# EAGLE board Pack Supervisor 97x127mm Rev B (EAGLE 7.2.0)
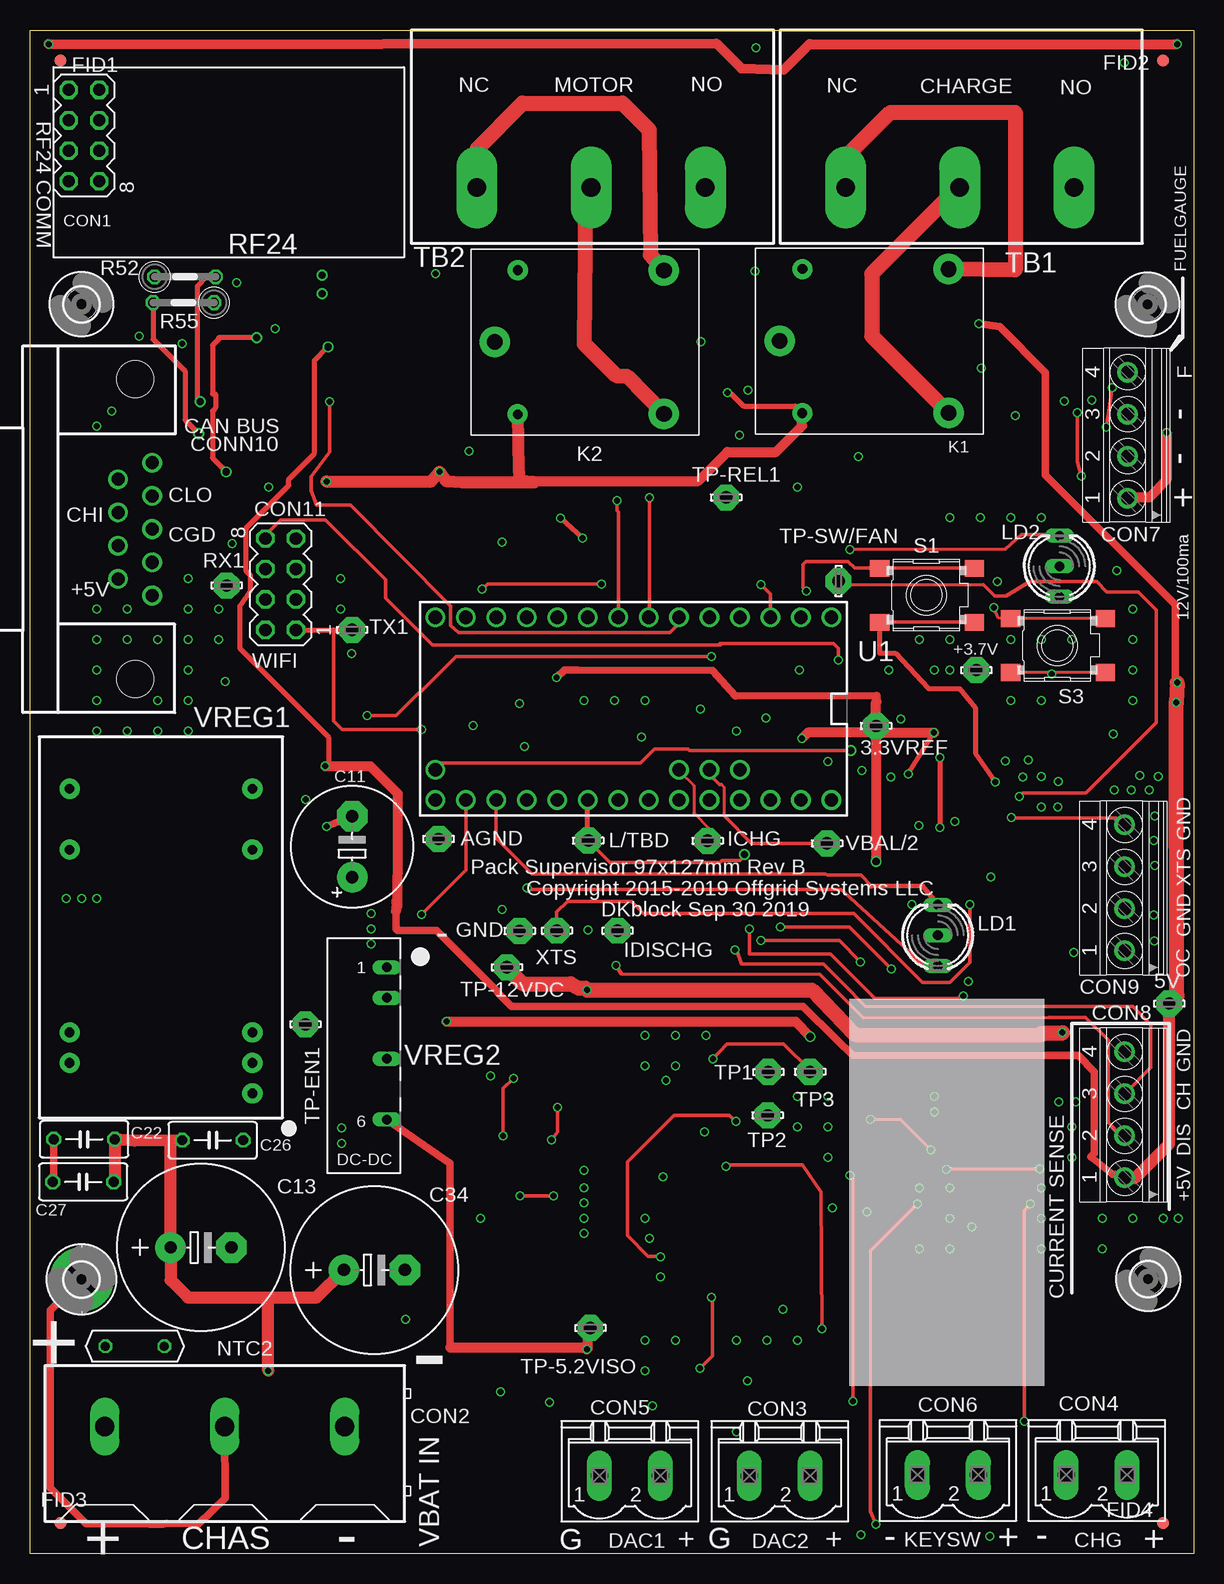
[diagram p2: board, top side]
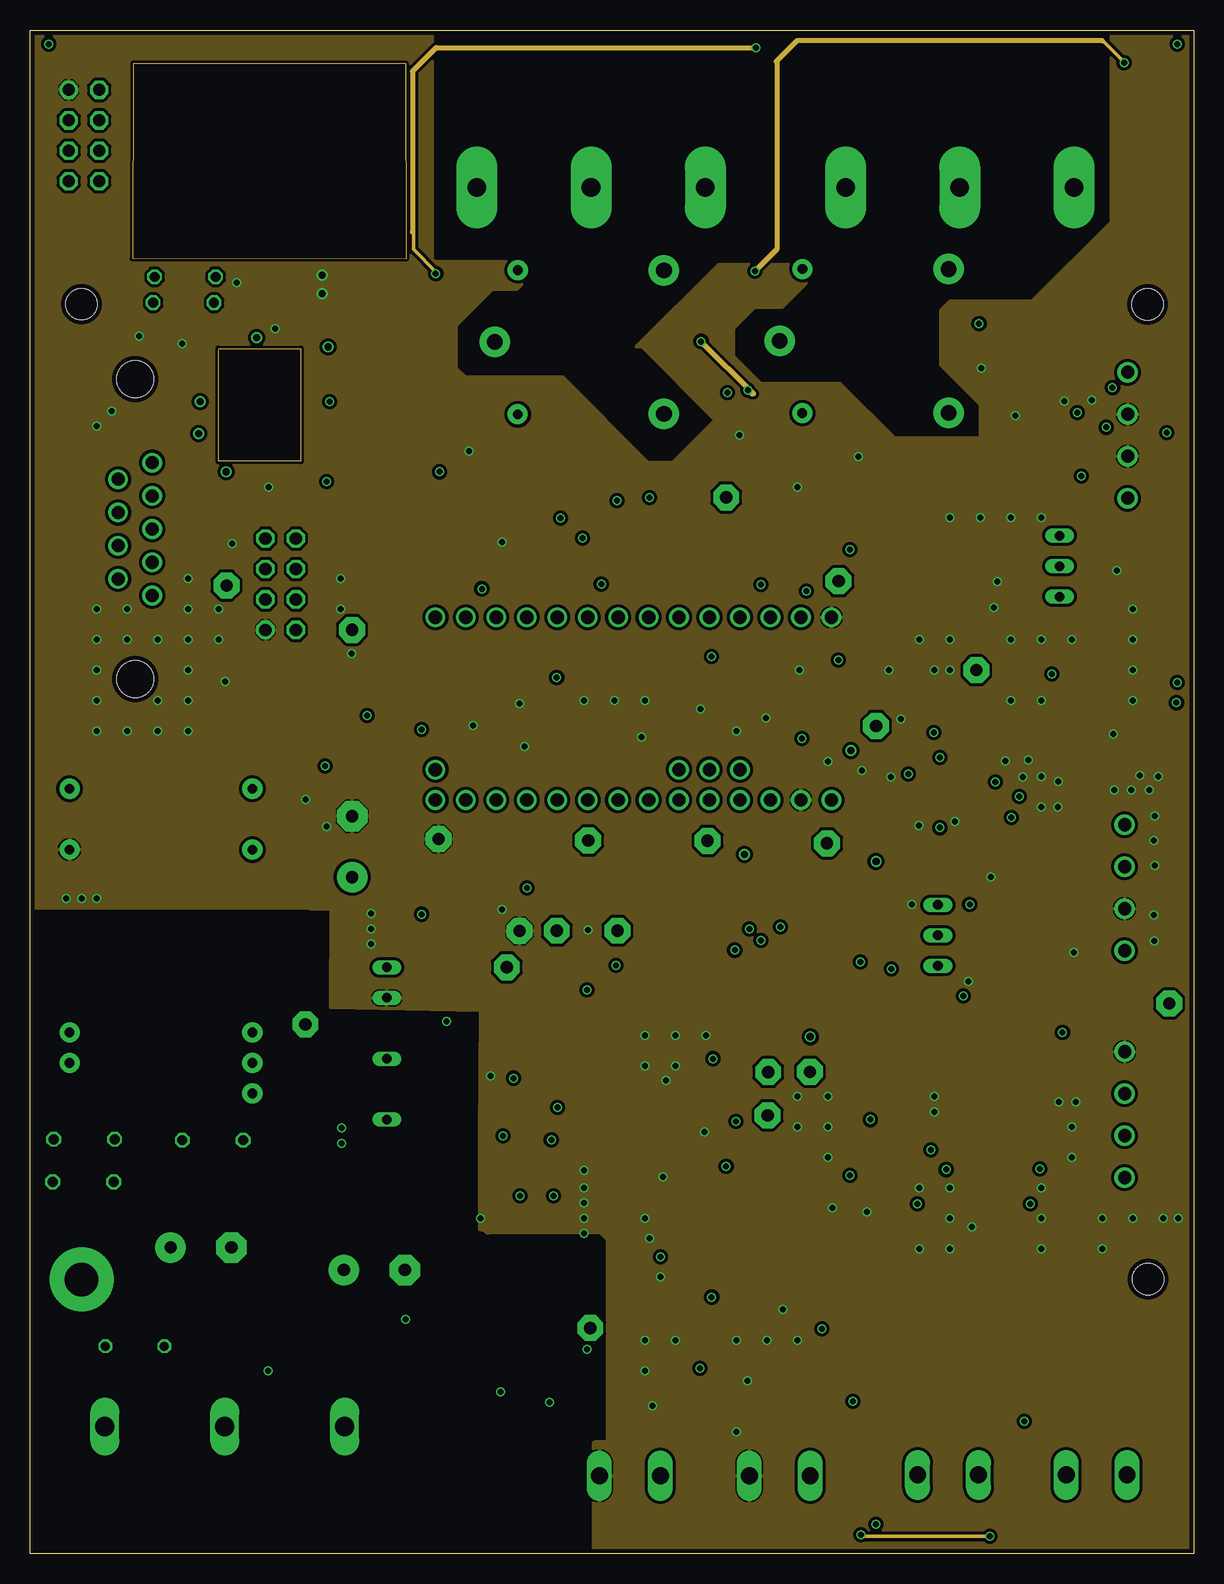
[diagram p3: board, inner layer InnerlayerGND1]
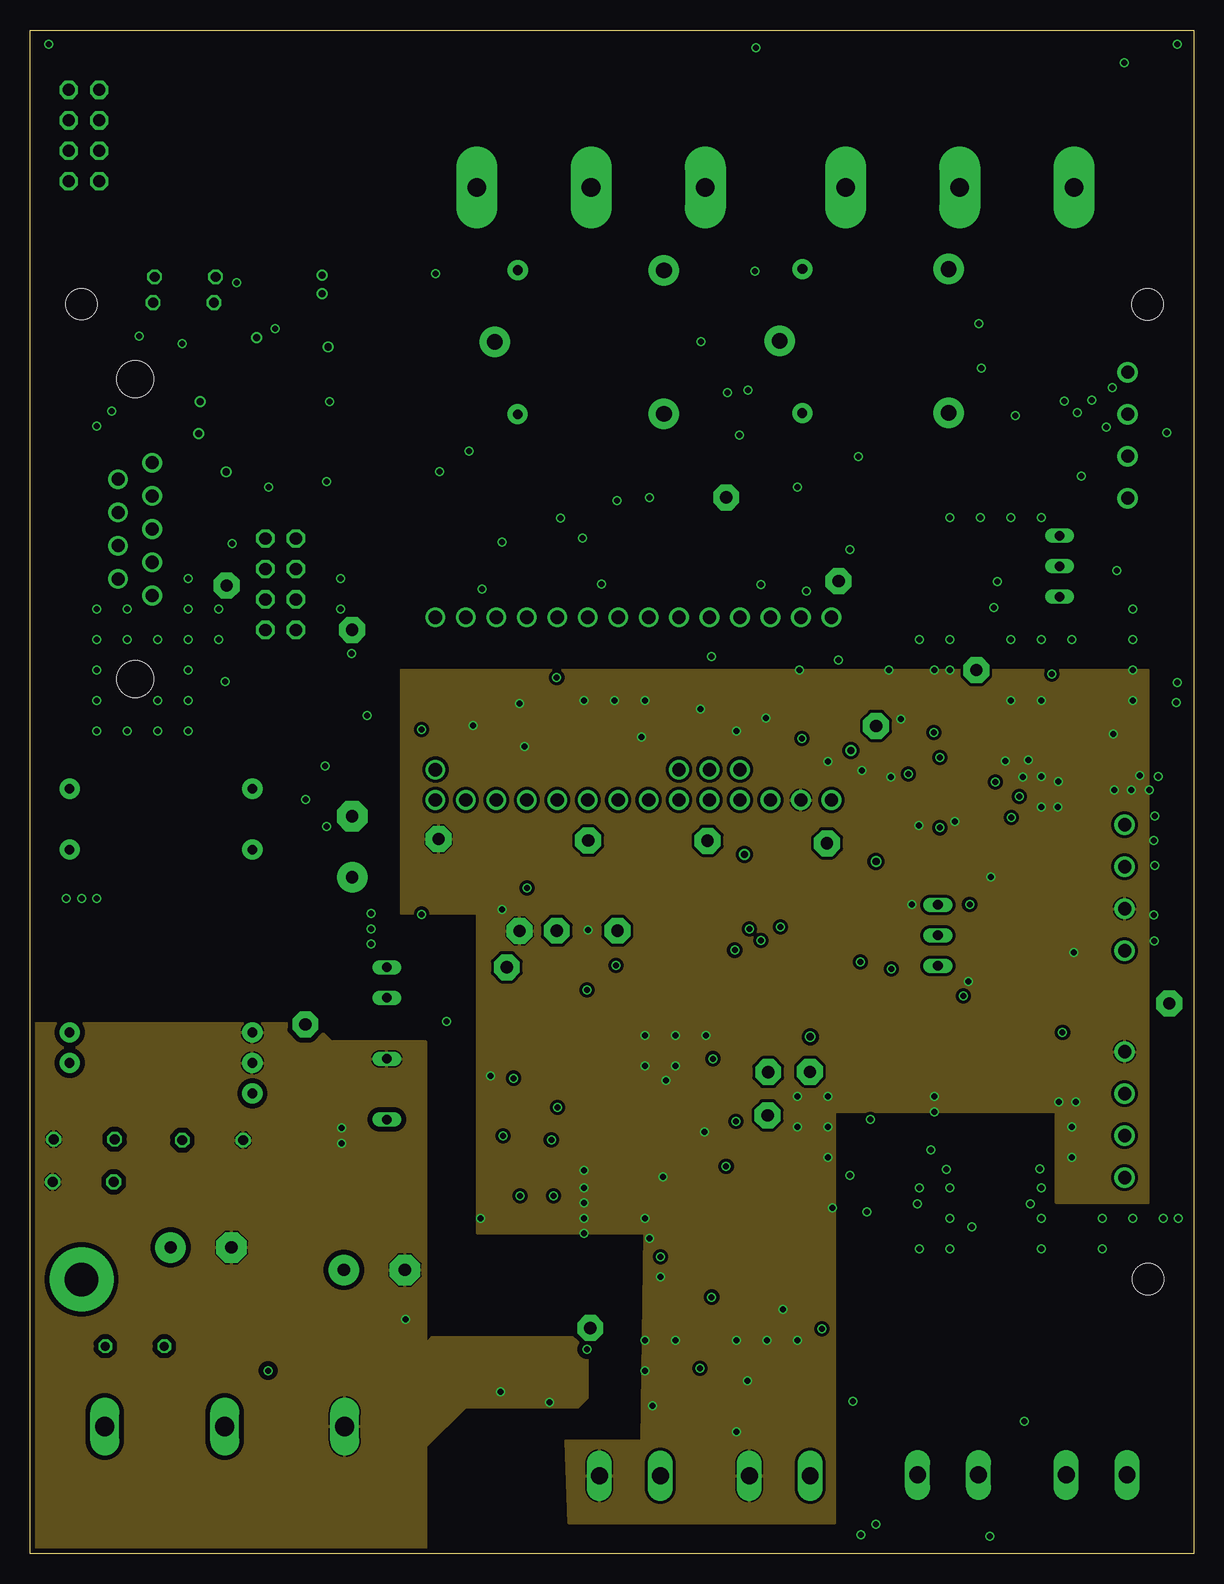
[diagram p4: board, inner layer InnerlayerAGND]
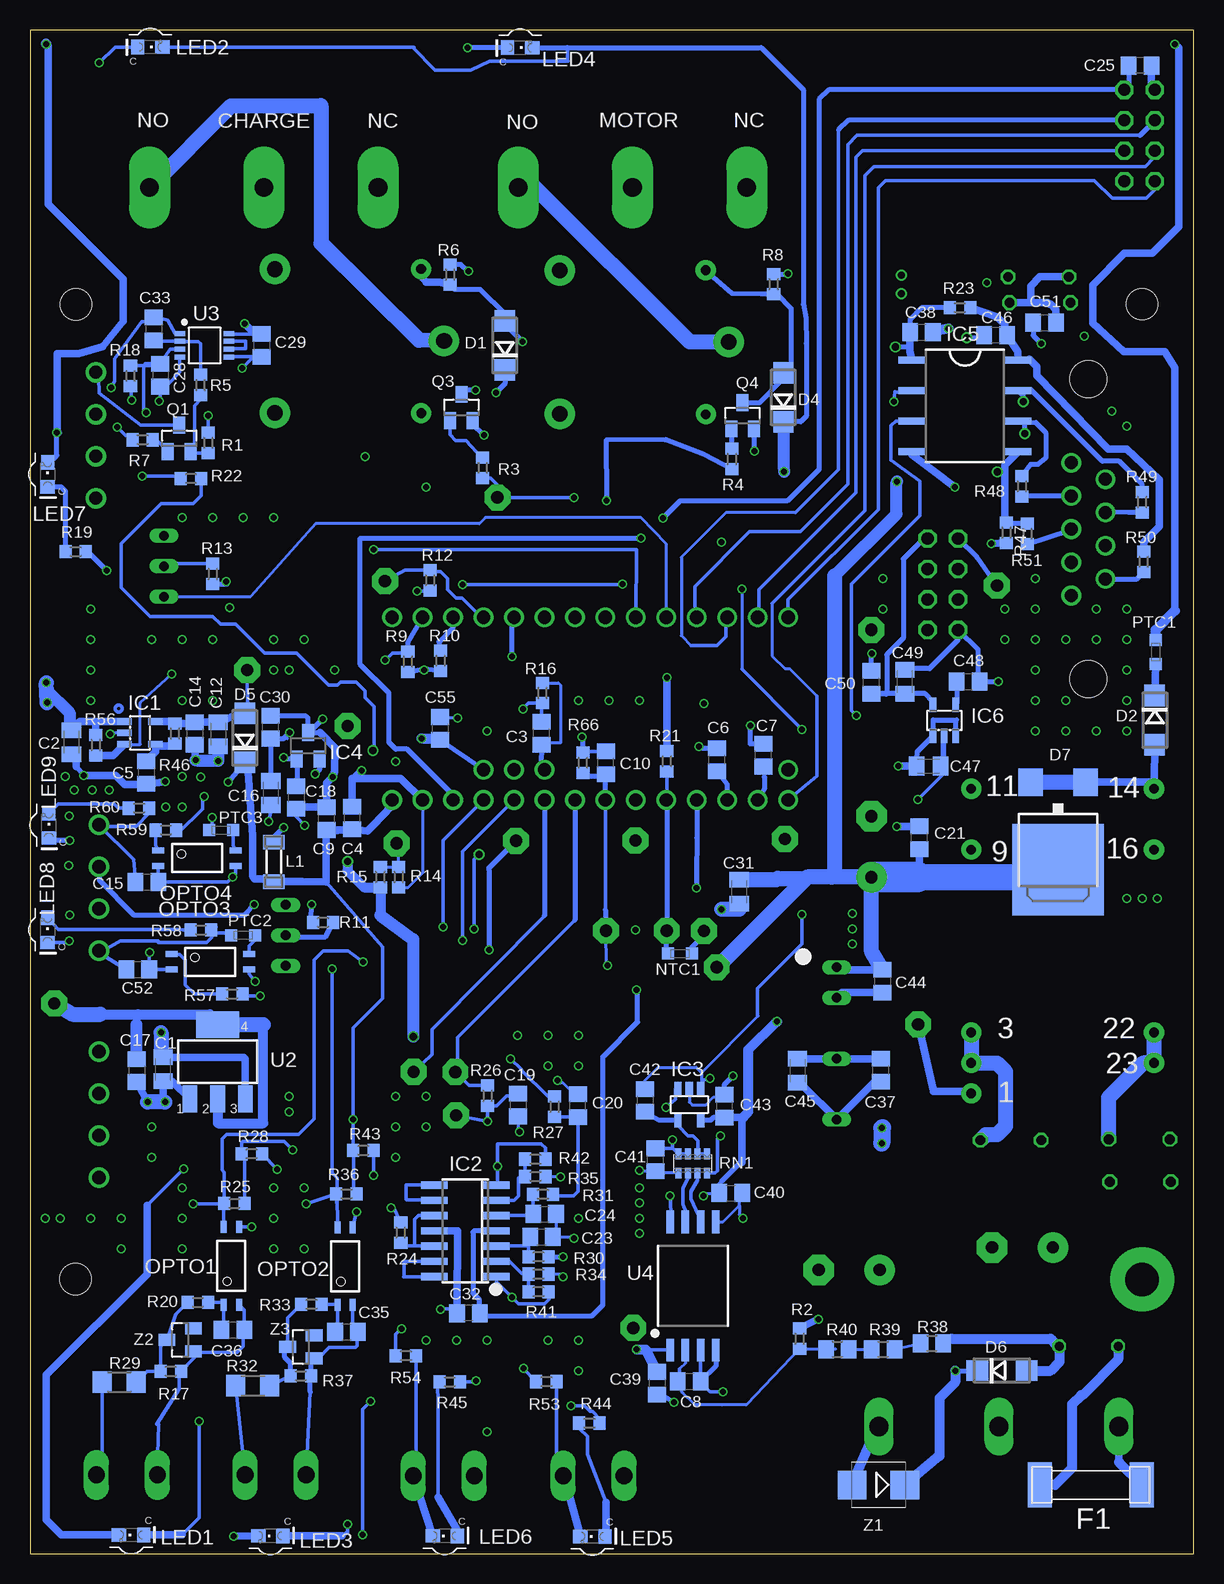
[diagram p5: board, bottom side, seen from below]

Size 97 x 127 mm. Coordinates in mm from the lower left corner, seen from the top.
Outline: 0,127 97,127 97,0 0,0
Outline: 0,0 0,127
Copper layers (1+2*15+16): Top 0.035559375mm / dielectric 0.17018125mm / InnerlayerGND1 0.01778125mm / dielectric 47mil / InnerlayerAGND 0.01778125mm / dielectric 0.17018125mm / Bottom 0.035559375mm
Design rules "Offgrid 4 layer design rules for low voltage areas on board": minimum track width 10mil, minimum drill 10mil, track to track 10mil, track to pad 10mil, pad to pad 10mil, via to via 10mil, smd to smd 5mil, copper to edge 15mil, drill to drill 5mil, minimum pad ring 7mil, minimum via ring 4mil, stop-mask expansion 3mil, vias tented up to drill 0mil, thermal gap 5mil

## Footprints (pad centres in the part's own frame; a part is rotated, then mirrored left to right if it is on the bottom)
LSP10 = drill 1.016 pad 2.159 octagon: MP 0,0
C0805K = smd 1.3 x 1.6: 1 -1,0; 2 1,0
TIMS_INDUCTOR_C0805 = smd 1.3 x 1.5: 1 -0.95,0; 2 0.95,0
E5-10,5 = drill 1.016 pad 2.54: + -2.54,0 | drill 1.016 pad 2.54 octagon: - 2.54,0
E5-13 = drill 1.016 pad 2.54: + -2.54,0 | drill 1.016 pad 2.54 octagon: - 2.54,0
RCL_C050-030X075 = drill 0.813 octagon: 1 -2.54,0; 2 2.54,0
C0805 = smd 1.3 x 1.5: 1 -0.95,0; 2 0.95,0
NRF24L01 = drill 1.016 octagon: 1 -1.27,3.81; 2 1.27,3.81; 3 -1.27,1.27; 4 1.27,1.27; 5 -1.27,-1.27; 6 1.27,-1.27; 7 -1.27,-3.81; 8 1.27,-3.81
TYCO-796739-3 = drill 1.6 long: 1 -10,-0.08; 2 0,-0.08; 3 10,-0.08
MSTBV2 = drill 1.397 long: 1 -2.54,0; 2 2.54,0
1751264 = drill 1.1 pad 1.7: 1 -5.25,-0.1; 2 -1.75,-0.1; 3 1.75,-0.1; 4 5.25,-0.1
MA04-2 = drill 1.016 octagon: 1 -3.81,-1.27; 2 -3.81,1.27; 3 -1.27,-1.27; 4 -1.27,1.27; 5 1.27,-1.27; 6 1.27,1.27; 7 3.81,-1.27; 8 3.81,1.27
H5M09RA = drill 1.092: 1 -5.537,1.422; 2 -2.769,1.422; 3 0,1.422; 4 2.769,1.422; 5 5.537,1.422; 6 -4.153,-1.422; 7 -1.384,-1.422; 8 1.384,-1.422; 9 4.153,-1.422 | hole 3.048: -12.497,0; 12.497,0
DO214AC = smd 1.8 x 1.7: A 2.05,0; C -2.05,0
TO252-FATPADS = smd 7.62 x 7.62: DRAIN 0,2.5 | smd 2.032 x 2.286: GATE -2.28,-4.8; SOURCE 2.28,-4.8
SCHURTER-UMT250 = smd 2 x 3.75: P$1 -4.21,0; P$2 4.29,0
TP10R = smd 1 x 1: TP 0,0
2,6 = hole 2.591: 0,0
2,8-PAD = drill 2.8 pad 5.334: B2,8 0,0
SOT23-5 = smd 0.55 x 1.2: 1 -0.95,-1.3; 2 0,-1.3; 3 0.95,-1.3; 4 0.95,1.3; 5 -0.95,1.3
SO14 = smd 0.6 x 2.2: 1 -3.81,-2.6; 2 -2.54,-2.6; 3 -1.27,-2.6; 4 0,-2.6; 5 1.27,-2.6; 6 2.54,-2.6; 7 3.81,-2.6; 8 3.81,2.6; 9 2.54,2.6; 10 1.27,2.6; 11 0,2.6; 12 -1.27,2.6; 13 -2.54,2.6; 14 -3.81,2.6
SOT23-5' = smd 0.6 x 1.2: 1 -0.95,-1.306; 2 0,-1.306; 3 0.95,-1.306; 4 0.95,1.306; 5 -0.95,1.306
SOT23 = smd 1 x 1.4: 1 -0.95,-1.1; 2 0.95,-1.1; 3 0,1.1
DUB-R-PDSO-G8 = smd 0.6 x 2.2: 1 -3.81,-4.445; 2 -1.27,-4.445; 3 1.27,-4.445; 4 3.81,-4.445; 5 3.81,4.445; 6 1.27,4.445; 7 -1.27,4.445; 8 -3.81,4.445
ORWH = drill 1.3 pad 2.54: COM -8,0.02; NC 6.09,-5.97; NO 6.09,6 | drill 0.813 pad 1.676: V+ -6.1,-6; V- -6.09,6.01
SM-1206 = smd 1.2 x 1.8: 1 -1.65,0; 2 1.65,0
DUOLED-C-5MM = drill 0.813 long: AR 2.54,0; AX -2.54,0; C 0,0
LITEON-LTST-S270KRKT = smd 1.1 x 1.2: ANODE 0,1 | smd 1.2 x 1.1: CATHODE 0,-1.05
0603 = smd 1 x 1: 1 -1,0; 2 1,0
D7-PACKAGE = drill 0.75 octagon: 1 -2.454,0; 2 2.454,0
MINI-FLAT-4 = smd 1 x 0.5: 1 -3.24,0.635; 2 -3.24,-0.635; 3 3.24,-0.635; 4 3.24,0.635
CT/CN0603 = smd 1 x 1: 1 -1,0; 2 1,0
R0603 = smd 1 x 1.1: 1 -0.85,0; 2 0.85,0
R1206 = smd 1.6 x 1.803: 1 -1.422,0; 2 1.422,0
R0805 = smd 1.3 x 1.5: 1 -0.95,0; 2 0.95,0
0207/5V = drill 0.813 octagon: 1 -2.54,0; 2 2.54,0
CTS742C083 = smd 0.5 x 0.9: 1 -1.2,-0.8; 2 -0.4,-0.8; 3 0.4,-0.8; 4 1.2,-0.8; 5 1.2,0.8; 6 0.4,0.8; 7 -0.4,0.8; 8 -1.2,0.8
PTS645 = smd 1.6 x 1.4: 1 -4.2,2.25; 2 3.7,2.25; 3 -4.2,-2.25; 4 3.7,-2.25
TE-5-1437652-4 = drill 1.549 pad 3.429 long: 1 -9.461,-0.08; 2 0.064,-0.08; 3 9.588,-0.08
TEENSY_3.0-DIP+ANALOG+DAC = drill 1.1: 0 -7.62,13.97; 1 -7.62,11.43; 2 -7.62,8.89; 3 -7.62,6.35; 3.3V 7.62,11.43; 4 -7.62,3.81; 5 -7.62,1.27; 6 -7.62,-1.27; 7 -7.62,-3.81; 8 -7.62,-6.35; 9 -7.62,-8.89; 10 -7.62,-11.43; 11 -7.62,-13.97; 12 -7.62,-16.51; 13 7.62,-16.51; 14 5.08,-16.51; 14/A0 7.62,-13.97; 15/A1 7.62,-11.43; 16/A2 7.62,-8.89; 17/A3 7.62,-6.35; 18/A4 7.62,-3.81; 19/A5 7.62,-1.27; 20/A6 7.62,1.27; 21/A7 7.62,3.81; 22/A8 7.62,6.35; 23/A9 7.62,8.89; A10 5.08,6.35; A11 5.08,3.81; AGND 7.62,13.97; AREF 5.08,8.89; GND -7.62,16.51; VIN 7.62,16.51
SOT223 = smd 1.219 x 2.235: 1 -2.311,-3.099; 2 0,-3.099; 3 2.311,-3.099 | smd 3.6 x 2.2: 4 0,3.099
LT6004-MSOP = smd 0.889 x 0.419: 1 -2.238,1.746; 2 -2.238,1.096; 3 -2.238,0.446; 4 -2.238,-0.205; 5 1.851,-0.205; 6 1.851,0.446; 7 1.851,1.096; 8 1.851,1.746
STRETCH-SO8 = smd 0.635 x 1.905: 1 -3.81,-5.339; 2 -2.54,-5.339; 3 -1.27,-5.339; 4 0,-5.339; 5 0,5.339; 6 -1.27,5.339; 7 -2.54,5.339; 8 -3.81,5.339
MR0811S-12 = drill 0.8 pad 1.676: 1 -7.62,10.16; 2 -7.62,7.62; 3 -7.62,5.08; 9 -7.62,-10.16; 11 -7.62,-15.24; 14 7.62,-15.24; 16 7.62,-10.16; 22 7.62,5.08; 23 7.62,7.62
MURATA-MEF = drill 0.813 long: 1 0,5.08; 2 0,2.54; 4 0,-2.54; 6 0,-7.62
SMB = smd 2.4 x 2.4: A 2.2,0; C -2.2,0
TIMS_DIODE_SOT23 = smd 1 x 1.4: 1 -0.95,-1.1; 2 0.95,-1.1; 3 0,1.1

## Placement (x,y rotation side)
3.3VREF  LSP10  [LSP10]  70.54,68.99 0 top
5V  LSP10  [LSP10]  94.97,45.85 0 top
+3.7V  LSP10  [LSP10]  78.89,73.63 0 top
AGND  LSP10  [LSP10]  34.06,59.56 0 top
C1  10uf/16V/X5R  [C0805K]  85.9,40.36 270 bottom
C2  10uf/16V/X5R  [C0805K]  93.55,67.64 270 bottom
C3  1/16V  [TIMS_INDUCTOR_C0805]  54.36,68.38 90 bottom
C4  1/16V  [TIMS_INDUCTOR_C0805]  70.13,61.32 90 bottom
C5  100p  [TIMS_INDUCTOR_C0805]  87.33,65.1 270 bottom
C6  .01u  [TIMS_INDUCTOR_C0805]  39.73,66.17 90 bottom
C7  .01u  [TIMS_INDUCTOR_C0805]  35.86,66.55 90 bottom
C8  1/16V  [TIMS_INDUCTOR_C0805]  42.04,14.35 0 bottom
C9  0.1/16V  [TIMS_INDUCTOR_C0805]  72.26,61.26 90 bottom
C10  1/16V  [TIMS_INDUCTOR_C0805]  49,65.92 90 bottom
C11  330/25V  [E5-10,5]  26.86,58.92 90 top
C12  10uf/16V/X5R  [C0805K]  81.31,68.3 270 bottom
C13  47/250V  [E5-13]  14.26,25.52 0 top
C14  0.1/30V  [TIMS_INDUCTOR_C0805]  83.26,68.35 270 bottom
C15  .01u  [TIMS_INDUCTOR_C0805]  87.25,55.98 0 bottom
C16  10uf/16V  [C0805K]  76.91,63.4 270 bottom
C17  1/16V  [TIMS_INDUCTOR_C0805]  88.11,40.26 270 bottom
C18  0.1/30V  [TIMS_INDUCTOR_C0805]  74.8,63.02 270 bottom
C19  1/16V  [TIMS_INDUCTOR_C0805]  56.31,37.39 270 bottom
C20  1/16V  [TIMS_INDUCTOR_C0805]  51.33,37.34 90 bottom
C21  1/16V  [TIMS_INDUCTOR_C0805]  22.86,59.66 90 bottom
C22  1uf/250V  [RCL_C050-030X075]  4.52,34.53 180 top
C23  1/16V  [TIMS_INDUCTOR_C0805]  54.36,26.39 0 bottom
C24  1/16V  [TIMS_INDUCTOR_C0805]  54.1,28.3 0 bottom
C25  1/16V  [TIMS_INDUCTOR_C0805]  4.47,124.04 180 bottom
C26  1uf/250V  [RCL_C050-030X075]  15.24,34.45 0 top
C27  1uf/250V  [RCL_C050-030X075]  4.44,30.98 180 top
C28  1/16V  [TIMS_INDUCTOR_C0805]  86.13,98.22 270 bottom
C29  1/16V  [TIMS_INDUCTOR_C0805]  77.7,100.71 270 bottom
C30  0.1/30V  [TIMS_INDUCTOR_C0805]  76.94,68.88 90 bottom
C31  10uf/16V/X5R  [C0805K]  37.87,55.17 270 bottom
C32  1/16V  [TIMS_INDUCTOR_C0805]  60.45,20.04 180 bottom
C33  1000p  [TIMS_INDUCTOR_C0805]  86.69,102.08 270 bottom
C34  47/250V  [E5-13]  28.71,23.64 0 top
C35  1/16V  [TIMS_INDUCTOR_C0805]  70.61,18.49 0 bottom
C36  1/16V  [TIMS_INDUCTOR_C0805]  80.09,18.64 0 bottom
C37  1/16V  [TIMS_INDUCTOR_C0805]  26.07,40.3 90 bottom
C38  1/16V  [TIMS_INDUCTOR_C0805]  22.68,101.8 0 bottom
C39  1/16V  [TIMS_INDUCTOR_C0805]  44.73,14.2 270 bottom
C40  1/16V  [TIMS_INDUCTOR_C0805]  38.58,30.05 0 bottom
C41  0.1  [TIMS_INDUCTOR_C0805]  44.86,32.82 90 bottom
C42  0.1  [TIMS_INDUCTOR_C0805]  45.72,37.77 270 bottom
C43  1/16V  [TIMS_INDUCTOR_C0805]  39.09,37.29 90 bottom
C44  1/16V  [TIMS_INDUCTOR_C0805]  25.93,47.7 270 bottom
C45  10uf/16V/X5R  [C0805K]  33.02,40.25 90 bottom
C46  1/16V  [TIMS_INDUCTOR_C0805]  16.5,101.58 0 bottom
C47  10uf/16V/X5R  [C0805K]  22.09,65.64 0 bottom
C48  100p  [TIMS_INDUCTOR_C0805]  18.79,72.68 0 bottom
C49  10uf/16V/X5R  [C0805K]  24.07,72.68 90 bottom
C50  0.1/30V  [TIMS_INDUCTOR_C0805]  26.85,72.62 90 bottom
C51  0.1  [TIMS_INDUCTOR_C0805]  12.42,102.62 0 bottom
C52  .01u  [TIMS_INDUCTOR_C0805]  88.01,48.69 0 bottom
C55  .01u  [C0805]  62.81,68.78 270 bottom
CON1  nRF24L01+ CONNECTOR  [NRF24L01]  4.5,118.2 0 top
CON2  TYCO-796739-3  [TYCO-796739-3]  16.23,10.67 0 top
CON3  Phoenix 1935161  [MSTBV2]  62.51,6.48 0 top
CON4  Phoenix 1935161  [MSTBV2]  88.93,6.55 0 top
CON5  Phoenix 1935161  [MSTBV2]  50.01,6.48 0 top
CON6  Phoenix 1935161  [MSTBV2]  76.53,6.55 0 top
CON7  1751264  [1751264]  91.41,93.22 90 top
CON8  1751264  [1751264]  91.16,36.58 90 top
CON9  1751264  [1751264]  91.16,55.5 90 top
CON11  WIFI  [MA04-2]  20.9,80.8 90 top
CONN10  DB-9 Assmann A-DF 09 A/KG-T4S  [H5M09RA]  8.77,85.39 270 top
D1  CDBA140-G  [DO214AC]  57.4,100.71 90 bottom
D2  CDBA140-G  [DO214AC]  3.25,69.47 270 bottom
D4  CDBA140-G  [DO214AC]  34.19,96.37 90 bottom
D5  CDBA140-G  [DO214AC]  79.07,68 90 bottom
D6  CDBA140-G  [DO214AC]  15.98,15.24 0 bottom
D7  RFN10B3STL  [TO252-FATPADS]  11.29,59.5 180 bottom
F1  250ma  [SCHURTER-UMT250]  8.61,5.71 0 bottom
FID1  FIDUCIALTP10R  [TP10R]  2.54,124.46 0 top
FID2  FIDUCIALTP10R  [TP10R]  94.46,124.46 0 top
FID3  FIDUCIALTP10R  [TP10R]  2.54,2.54 0 top
FID4  FIDUCIALTP10R  [TP10R]  94.46,2.54 0 top
GND  LSP10  [LSP10]  40.82,51.89 0 top
H1  MOUNT-HOLE  [2,6]  4.29,104.14 0 top
H2  MOUNT-HOLE  [2,6]  93.22,22.87 0 top
H3  MOUNT-PAD-ROUND2.8  [2,8-PAD]  4.29,22.85 0 top
H4  MOUNT-HOLE  [2,6]  93.17,104.13 0 top
IC1  AP2202K-3.3TRG1  [SOT23-5]  87.83,68.4 270 bottom
IC2  TLC27L4CDR  [SO14]  60.71,26.9 90 bottom
IC3  OPA237N  [SOT23-5']  42.04,37.41 180 bottom
IC4  REF3033  [SOT23]  73.81,67.34 0 bottom
IC5  ISO1050DUB  [DUB-R-PDSO-G8]  19.05,95.67 270 bottom
IC6  AP2202K-3.3TRG1  [SOT23-5]  20.78,69.45 0 bottom
ICHG  LSP10  [LSP10]  56.49,59.41 0 top
IDISCHG  LSP10  [LSP10]  48.97,51.92 0 top
K1  ORWH  [ORWH]  70.48,101.07 0 top
K2  ORWH  [ORWH]  46.76,100.97 0 top
L1  8.2uh  [SM-1206]  76.68,57.66 270 bottom
L/TBD  LSP10  [LSP10]  46.53,59.43 0 top
LD1  "TRANSMITTING/FAULT"  [DUOLED-C-5MM]  75.69,51.54 90 top
LD2  "STATUS"  [DUOLED-C-5MM]  85.83,82.3 90 top
LED1  LITEON-LTST-S270KRKT  [LITEON-LTST-S270KRKT]  88.57,1.55 90 bottom
LED2  LITEON-LTST-S270KRKT  [LITEON-LTST-S270KRKT]  86.97,125.58 270 bottom
LED3  LITEON-LTST-S270KRKT  [LITEON-LTST-S270KRKT]  76.96,1.47 90 bottom
LED4  LITEON-LTST-S270KRKT  [LITEON-LTST-S270KRKT]  56.13,125.53 270 bottom
LED5  LITEON-LTST-S270KRKT  [LITEON-LTST-S270KRKT]  50.11,1.42 90 bottom
LED6  LITEON-LTST-S270KRKT  [LITEON-LTST-S270KRKT]  62.43,1.47 90 bottom
LED7  LITEON-LTST-S270KRKT  [LITEON-LTST-S270KRKT]  95.53,89.97 0 bottom
LED8  LITEON-LTST-S270KRKT  [LITEON-LTST-S270KRKT]  95.53,51.99 0 bottom
LED9  LITEON-LTST-S270KRKT  [LITEON-LTST-S270KRKT]  95.43,60.71 0 bottom
NTC1  100K  [0603]  42.82,50.01 0 bottom
NTC2  Cantherm MF72-012D7  [D7-PACKAGE]  8.74,17.27 180 top
OPTO1  TLP291  [MINI-FLAT-4]  80.21,23.98 90 bottom
OPTO2  TLP291  [MINI-FLAT-4]  70.74,23.95 90 bottom
OPTO3  TLP291  [MINI-FLAT-4]  81.97,49.33 0 bottom
OPTO4  TLP291  [MINI-FLAT-4]  83.08,57.96 0 bottom
PTC1  PTC FUSE - 100ma  [CT/CN0603]  3.15,75.13 270 bottom
PTC2  100ma  [CT/CN0603]  79.22,51.54 0 bottom
PTC3  100ma  [CT/CN0603]  81.05,60.3 0 bottom
Q1  IRLML2502TRPBF  [SOT23]  84.56,92.96 0 bottom
Q3  IRLML2502TRPBF  [SOT23]  61.04,95.53 0 bottom
Q4  IRLML2502TRPBF  [SOT23]  37.59,94.84 0 bottom
R1  10  [R0603]  82.14,92.58 90 bottom
R2  43.2k/0.1%  [R0603]  32.84,17.91 270 bottom
R3  1K  [R0603]  59.26,90.5 270 bottom
R4  1K  [R0603]  38.48,91.24 270 bottom
R5  1K  [R0603]  82.78,97.41 270 bottom
R6  1k  [R0603]  61.98,106.6 270 bottom
R7  20K  [R0603]  87.6,92.84 180 bottom
R8  1k  [R0603]  35,105.82 270 bottom
R9  200k  [R0603]  65.5,74.35 90 bottom
R10  200k  [R0603]  62.77,74.42 90 bottom
R11  330  [R0603]  72.57,52.6 180 bottom
R12  20k  [R0603]  63.64,81.13 90 bottom
R13  330  [R0603]  81.76,81.66 270 bottom
R14  20K  [R0603]  66.27,56.39 90 bottom
R15  20K  [R0603]  67.79,56.39 270 bottom
R16  200k  [R0603]  54.28,71.73 90 bottom
R17  1M  [R0603]  85.27,15.19 180 bottom
R18  100k  [R0603]  88.62,98.17 90 bottom
R19  1k  [R0603]  93.19,83.52 0 bottom
R20  1.8k  [R0603]  83.01,20.93 180 bottom
R21  200k  [R0603]  43.92,66.04 90 bottom
R22  1M  [R0603]  83.59,89.61 0 bottom
R23  10  [R0603]  19.47,103.85 0 bottom
R24  20K  [R0603]  66.09,26.75 270 bottom
R25  10K  [R0603]  79.96,29.18 180 bottom
R26  10K  [R0603]  58.85,38.15 90 bottom
R27  10K  [R0603]  53.26,37.24 90 bottom
R28  1K  [R0603]  78.51,33.32 180 bottom
R29  3.3k/1206/5%  [R1206]  89.56,14.3 180 bottom
R30  10K  [R0603]  54.61,24.74 0 bottom
R31  10K  [R0603]  54.23,29.95 0 bottom
R32  3.3k/1206/5%  [R1206]  78.44,14 180 bottom
R33  1.8k  [R0603]  73.53,20.78 180 bottom
R34  10K  [R0603]  54.61,23.29 0 bottom
R35  10K  [R0603]  54.86,31.42 0 bottom
R36  10K  [R0603]  70.61,29.97 180 bottom
R37  1M  [R0603]  74.42,14.81 180 bottom
R38  1.0M/0.1%  [R0805]  21.82,17.53 0 bottom
R39  1.0M/0.1%  [R0805]  25.88,17.02 0 bottom
R40  1.0M/0.1%  [R0805]  29.69,17.02 0 bottom
R41  20K  [R0603]  54.61,21.82 0 bottom
R42  20K  [R0603]  54.86,32.87 0 bottom
R43  1K  [R0603]  69.22,33.6 180 bottom
R44  1.8k  [R0603]  50.37,10.87 180 bottom
R45  1.8k  [R0603]  62,14.3 0 bottom
R46  1M  [R0603]  84.91,68.35 90 bottom
R47  10  [R0603]  15.6,85.09 270 bottom
R48  10  [R0603]  14.31,88.96 270 bottom
R49  10  [R0603]  4.28,87.64 270 bottom
R50  10  [R0603]  4.15,82.66 270 bottom
R51  10  [R0603]  13.85,85 270 bottom
R52  TBD  [0207/5V]  12.93,106.43 0 top
R53  10  [R0603]  53.95,14.33 0 bottom
R54  10  [R0603]  65.66,16.48 0 bottom
R55  TBD  [0207/5V]  12.8,104.27 180 top
R56  200k  [R0603]  91.52,67.39 270 bottom
R57  20K  [R0603]  80.14,46.63 0 bottom
R58  20k  [R0603]  82.75,51.97 0 bottom
R59  20K  [R0603]  85.67,60.3 0 bottom
R60  20k  [R0603]  87.91,62.13 0 bottom
R66  200k  [R0603]  50.9,65.91 270 bottom
RN1  10k, 1%  [CTS742C083]  41.76,32.51 0 bottom
RX1  LSP10  [LSP10]  16.38,80.7 0 top
S1  CONNECT  [PTS645]  75.03,79.88 0 top
S3  RESET  [PTS645]  85.95,75.69 0 top
TB1  TE-5-1437652-4  [TE-5-1437652-4]  77.57,113.79 180 top
TB2  TE-5-1437652-4  [TE-5-1437652-4]  46.84,113.79 180 top
TP1  LSP10  [LSP10]  61.54,40.13 0 top
TP2  LSP10  [LSP10]  61.49,36.53 0 top
TP3  LSP10  [LSP10]  65.02,40.16 0 top
TP-5.2VISO  LSP10  [LSP10]  46.71,18.8 0 top
TP-12VDC  LSP10  [LSP10]  39.75,48.87 0 top
TP-EN1  LSP10  [LSP10]  22.96,44.12 0 top
TP-REL1  LSP10  [LSP10]  58.04,88.04 0 top
TP-SW/FAN  LSP10  [LSP10]  67.41,81.05 270 top
TX1  LSP10  [LSP10]  26.85,76.99 0 top
U1  TEENSY_3.1  [TEENSY_3.0-DIP+ANALOG+DAC]  50.31,70.42 270 top
U2  SPX1117  [SOT223]  81.36,41 0 bottom
U3  LT6004-MSOP  [LT6004-MSOP]  82.27,99.95 0 bottom
U4  ACPL-C87X  [STRETCH-SO8]  39.83,22.3 0 bottom
VBAL/2  LSP10  [LSP10]  66.45,59.2 0 top
VREG1  MR0811S-12  [MR0811S-12]  10.92,48.51 180 top
VREG2  Murata MEF1S1205SPC  [MURATA-MEF]  29.74,43.79 0 top
XTS  LSP10  [LSP10]  43.92,51.92 0 top
Z1  160V  [SMB]  26.26,5.71 180 bottom
Z2  10V  [TIMS_DIODE_SOT23]  84.48,17.81 90 bottom
Z3  10V  [TIMS_DIODE_SOT23]  74.42,17.22 90 bottom

## Tracks (layer width: path | path; a pad name or v marks a point on that pad's centre or on a via)
0-UNUSED  (via drill 0.5)
  Top 0.305: CON11.8 19.63,84.89 20.9,86.16 24.66,86.16 29.64,81.18 29.64,79.65 33.55,75.74 57.43,75.74 | 57.43,75.74 57.58,75.74 | v67.39,74.47 67.39,75.44 66.98,75.84 57.53,75.84 57.43,75.74
  Bottom 0.305: v67.39,74.47 66.78,75.08 65.51,75.08 R9.2
  Bottom 0.406: R9.2 65.47,75.98 U1.0 | RX1.MP 18.03,83.01 CON11.8
5.2V-ISO  (via drill 0.5)
  Top 0.406: TP-5.2VISO.MP 46.58,17.12 43.33,17.17
  Top 0.61: 35.03,17.17 35.03,32.51 VREG2.6
  Top 0.813: 35.03,17.17 43.33,17.17 45.95,17.17 46.51,17.07 46.51,18.44 v46.43,17.02
  Bottom 0.305: U4.1 45.35,16.96 C39.1
  Bottom 0.406: C37.1 26.57,39.34
  Bottom 0.61: C45.1 32.59,39.36 32.59,39.01 VREG2.6 26.57,39.34
  Bottom 0.813: v46.43,17.02 45.68,17.02 C39.1
5V-ESP
  Bottom 0.406: CON11.7 22.5,84.61 24.21,82.91 24.21,76.3 25.58,74.93 25.58,71.68 25.63,71.63 26.34,71.63 | 26.34,71.63 26.81,71.63 C50.1 | 26.34,71.63 26.29,71.68 C49.1 22.38,71.68 21.73,71.03 IC6.5
12V/100MA-OUTPUT  (via drill 0.5)
  Top 0.813: v1.55,125.83 57.23,125.88 59.31,123.8 62.86,123.7 65,125.83 v95.63,125.83 | v94.77,93.42 94.77,89.51 93.29,88.04 91.84,88.04 CON7.1
  Bottom 0.406: LED7.ANODE 95.34,90.97 94.77,91.54 v94.77,93.42
  Bottom 0.61: v94.77,93.42 94.67,93.42 94.72,93.47 94.72,100.03 92.94,100.03 90.96,100.58 89.23,102.72 89.23,106.22 95.48,112.47 95.48,125.68 v95.63,125.83 | 1.55,78.59 1.55,98.86 2.41,100.18 5.82,100.18 8.41,102.56 8.41,105.72 5.77,108.41 3.43,108.41 1.24,110.59 1.24,125.53 v1.55,125.83
  Bottom 0.813: PTC1.1 3.15,76.99 1.55,78.59 | v95.63,125.83 95.68,125.88
12VDC/666MA  (via drill 0.5)
  Top 0.406: v58.14,96.77 58.34,96.77 59.46,95.66 63.8,95.66 K1.V+ 64.36,95.05
  Top 0.813: 40.87,89.41 55.73,89.41 58.14,91.82 62.2,91.82 64.36,93.98 64.36,95.05
  Top 1.016: K2.V+ 40.74,90.3 40.87,89.41 42.04,89.31 36.04,89.31 34.67,89.41 v34.14,90.17 33.45,89.36 v24.71,89.36
  Top 1.27: v86.08,43.43 86.03,43.38 84.35,43.38 84.35,43.23 68.76,43.23 65.17,46.97 v46.44,46.97 46.27,47.14 45.75,47.14 45.08,47.5 41.07,47.5 39.75,48.82 TP-12VDC.MP
  Bottom 0.305: 58.29,19.79 59.25,19.79 59.29,19.83 C32.1 | LED2.ANODE 65.1,125.58 | 65,125.58 65.1,125.58 | 65.1,125.58 63.22,123.65 60.27,123.65 58.7,124.41 52.15,124.41 52.2,124.46 52.2,125.53
  Bottom 0.406: IC2.4 59.94,26.9 60.07,26.77 60.07,21.69 59.56,21.18 59.56,20.1 C32.1 | LED4.ANODE 52.2,125.53 36.04,125.53 32.54,122.02 32.54,104.14 32.31,103 32.28,100.89 32.28,94.79 32.74,94.34 34.17,94.34 D4.C | 59.29,19.83 50.14,19.83 49.25,20.73 49.25,41.4 46.35,44.3 46.35,46.89 v46.44,46.97 | D1.C 57.4,97.51 v58.14,96.77
  Bottom 0.61: C1.1 79.18,41.36 79.07,41.25 79.07,37.92 U2.3 | C44.1 29.52,48.65 VREG2.1 | C21.1 22.86,56.56 23.04,56.38
  Bottom 1.016: 29.92,81.51 24.76,86.67 24.76,89.31 v24.71,89.36 | D4.C 34.19,90.6 v34.14,90.17
  Bottom 1.27: v86.08,43.43 86.08,41.54 C1.1 | C44.1 26.85,50.17 C11.+ 30.15,56.38 | 30.15,56.38 32.24,56.38 32.33,56.29 | 32.33,56.29 TP-12VDC.MP | 29.92,81.51 29.92,56.61 30.15,56.38 | C31.1 34.79,56.17 34.67,56.29 32.33,56.29
  Bottom 2.184: 23.04,56.38 12.38,56.38
  Bottom 2.54: C11.+ 23.04,56.38 | 12.38,56.38 12.32,56.44 11.85,56.44 D7.DRAIN
+3.3VREF  (via drill 0.5, 0.6)
  Top 0.305: v40.87,29.82 v43.66,29.82
  Top 0.406: 70.64,68.43 3.3VREF.MP | 42.95,44.35 43,44.3 | v73.23,64.97 73.18,64.97 v75.36,68.43
  Top 0.61: v43.92,73.03 44.55,73.64 45.64,73.66 56.9,73.61 58.8,71.48 70.56,71.53 70.59,71.5 70.59,70.99
  Top 0.813: v34.72,44.35 42.95,44.35 63.83,44.35 v65.05,43.08 | v70.54,57.68 3.3VREF.MP 70.54,70.94 70.59,70.99 | v64.36,67.94 64.85,68.43 70.64,68.43 v75.36,68.43
  Bottom 0.254: IC4.2 72.86,66.59 | 75.56,67.92 76.38,67.92 76.67,67.92 C30.1
  Bottom 0.305: 43.74,27.53 U4.8 43.51,27.77 v43.66,29.82 | v40.87,29.82 40.84,30 C40.1 39.6,30.08 39.6,30.79 39.34,31.04 38.84,31.55 38.73,31.55 | C43.1 37.68,36.34 37.67,36.32
  Bottom 0.406: C55.2 59.31,65.45 U1.AREF | 70.61,69.24 3.3VREF.MP | C43.1 40.04,36.34 40.26,36.12 IC3.5 | C30.1 76.94,64.27 C16.1 | 76.38,67.92 75.87,67.92 v75.36,68.43 | 37.67,32.61 37.77,32.61 39.34,31.04 | 72.86,66.59 72.86,65.34 v73.23,64.97
  Bottom 0.61: v43.92,73.03 R21.2 | 37.67,36.32 37.67,32.61 | C43.1 37.55,36.34
  Bottom 0.813: 37.55,36.34 37.11,36.83 37.11,42.01 v34.72,44.35 | 67.79,53.19 R15.2 67.81,55.52 69.16,55.52 70.54,56.9 v70.54,57.68 | v64.36,67.94 62.93,67.94 C55.2
  Bottom 1.016: 67.79,53.19 65.05,51.21 v65.05,43.08
+3.4VD  (via drill 0.5)
  Top 0.305: S1.3 S1.4 | v70.06,36.17 72.57,36.17 v75.11,33.63
  Top 0.406: S1.3 70.83,75.05 72.14,75.05 74.9,72.08 77.5,72.08 78.82,70.46 78.82,66.7 v80.49,64.31
  Bottom 0.305: R36.1 69.76,29.76 70.03,30.02 70.03,33.57 R43.2 v70.06,36.17 70.06,43.8 67.59,46.28 67.59,50.55 72.31,55.98 | v75.11,33.63 75.82,34.34 79.27,34.34 79.36,34.25 R28.2 79.11,33.07 R25.1
  Bottom 0.406: 78.87,65.73 78.71,65.84 D5.C 80.45,64.31 v80.49,64.31 | 76.91,56.24 L1.2
  Bottom 0.61: U1.VIN 66.82,62.34 68.45,60.66 68.87,60.25 C4.1 70.18,60.31 | L1.2 74.32,56.01 72.31,55.98 72.31,60.25 70.18,60.31 | 78.87,65.73 78.46,59.82 78.46,56.46 78.36,56.34 78.26,56.24 76.91,56.24 | C9.1 70.18,60.31
+3.65VD
  Bottom 0.305: 85.06,69.35 R46.2 | 83.21,69.2 C14.1 | 81.25,69.3 C12.1 81.25,69.25 | +3.7V.MP 78.87,69.95 D5.A 78.72,70.16 79.43,70.16
  Bottom 0.61: IC1.5 85.06,69.35 | R46.2 83.21,69.2 | C14.1 81.25,69.3 | 81.25,69.25 79.43,70.16
+3.300VA  (via drill 0.5)
  Top 0.406: v75.87,66.34 v75.87,60.5
  Bottom 0.305: L1.1 76.81,58.93
  Bottom 0.406: 74.65,64.06 74.7,64.41 74.7,65.87 IC4.1 75.61,66.23 v75.87,66.34 | v75.87,60.5 76.99,59.41 L1.1
  Bottom 0.61: C18.1 74.65,64.06
+5
  Bottom 0.406: CONN10.9 4.72,81.24 R50.2
+5V  (via drill 0.5, 0.6)
  Top 0.406: 24.92,65.63 24.92,68.02 17.5,75.44 17.5,78.99 18.39,80.26 18.39,81.53 18.01,81.92 18.01,85.47 21.56,89.03 21.56,89.53 23.72,91.69 23.72,99.44 v24.87,100.58
  Top 0.61: v79.12,102.51 80.85,102.26 84.66,98.45 84.66,89.92 95.48,79.1 95.48,72.75 v95.63,72.59 | 30.51,53.54 30.51,52.07 30.66,51.92 33.91,51.92 38.99,46.84 38.99,46.79 40.16,45.62 64.44,45.62 67.18,42.88 68.61,41.5 87.38,41.5 88.75,40.13 88.75,33.36 88.45,33.06 90.27,31.62 90.96,31.62 CON8.1
  Top 0.813: v24.61,65.63 24.92,65.63 28.37,65.63 30.66,63.35 30.66,59.23 30.61,53.95 30.56,54.36 30.51,53.54
  Top 1.016: CON8.1 92.13,31.33 94.97,34.16 5V.MP
  Top 1.27: 5V.MP 95.61,46.48 95.58,71.07 v95.58,70.92 v95.63,72.59
  Bottom 0.305: C29.1 80.39,101.66 U3.8
  Bottom 0.406: 93.55,69.04 93.69,68.78 C2.1 | 95.88,72.64 v95.63,72.59 | R23.1 22.67,103.85 23.65,102.87 23.65,101.69 C38.1 | C47.1 23.04,66.84 IC6.1 21.73,69.48 21.72,69.49 19.74,69.49 19.83,69.4 IC6.3 | v24.87,100.58 23.76,100.58 23.63,100.71
  Bottom 0.61: IC1.1 91.52,69.35 | 91.52,69.35 92.84,69.35 C2.1 | R56.1 91.52,69.35 | C47.1 v24.61,65.64 v24.61,65.63 | C38.1 23.63,100.71 23.63,100.23 IC5.1 | C29.1 78.22,101.66 v79.12,102.51 | 88.11,44.07 88.11,44.83 87.99,44.96
  Bottom 0.813: U2.2 81.36,35.86 77.55,35.86 77.55,44.09 | 91.11,44.96 87.99,44.96 82.02,44.96 U2.4
  Bottom 1.016: v95.58,70.92 95.58,72.54 v95.63,72.59 95.63,72.03 93.7,70.1 93.7,68.79 C2.1 | C17.1 88.11,44.07
  Bottom 1.27: U2.4 77.55,44.09 | 5V.MP 93.45,44.96 91.11,44.96 | v95.58,70.92 v95.63,72.59
ADC-L3  (via drill 0.5, 0.6)
  Top 0.305: v59.97,52.07 59.97,49.99 66.73,49.99 70.43,46.28 77.6,46.28 v77.8,46.48 | v59.56,58.27 59.66,58.22 59.21,57.76 57.68,57.76 57.53,57.61 48.36,57.61 L/TBD.MP
  Top 0.406: L/TBD.MP 46.5,59.34 U1.18/A4
  Bottom 0.305: v59.97,52.07 59.97,57.86 v59.56,58.27 | v77.8,46.48 79.13,46.48 R57.2
ADS
  Bottom 0.406: K2.V- 38.47,105.05 36.04,105 35.04,105 R8.2 34.74,104.97 33.55,103.78 33.55,99.05 D4.A 34.26,98.34 34.26,97.84 36.16,95.94 Q4.3
ASDF  (via drill 0.5)
  Top 0.305: 56.9,21.44 56.9,16.48 v55.85,15.44
  Top 0.406: 56.9,21.44 v56.83,21.37
  Bottom 0.305: IC2.1 58.11,22.65 v56.83,21.37 56.26,20.8 54.1,20.8 53.72,21.18 53.72,22.03 R41.2 | v55.85,15.44 55.85,15.38 R53.1
CE
  Bottom 0.305: 4.44,118.21 28.07,118.21 28.83,117.45 28.83,89.15 32.79,85.19 37.01,85.19 41.58,80.62 41.58,78.2 U1.9
  Bottom 0.406: CON1.3 3.23,119.43 4.44,118.21
CHARGER-IN  (via drill 0.5)
  Top 0.305: v60.93,51.11 67.49,51.11 v69.21,49.33 | v82.88,11.02 82.88,28.6 83.44,29.16 v83.39,29.16
  Bottom 0.305: v60.93,51.11 60.93,58.52 U1.22/A8 | v69.21,49.33 70.48,50.24 72.57,50.24 73.33,49.48 73.33,36.22 74.6,34.95 80.59,34.95 81,34.54 81,31.98 80.81,31.79 R25.2 | OPTO1.4 80.85,29.15 R25.2 | 84.33,1.55 82.88,3 v82.88,11.02 | v83.39,29.16 80.83,29.16 R25.2
  Bottom 0.61: LED1.CATHODE 84.33,1.55
CHASSIS-GND
  Top 0.61: CON2.2 16.28,4.59 14.07,2.46 11.4,2.54 11.05,2.44 9.98,2.44 4.7,2.49 1.7,5.49 1.7,20.26 H3.B2,8
CHGINLO
  Bottom 0.305: OPTO1.2 79.14,20.3 C36.2 79.24,18.54 79.24,17.26 79.73,16.76 82.84,16.76 83.38,16.23 | Z2.1 83.38,16.23 | 83.38,16.23 R17.1 84.56,15.05 84.56,13.72 86.44,10.77 86.28,10.77 86.39,7.01 CON4.1
CHI
  Bottom 0.406: R49.2 5.44,86.79 6.73,86.82 7.39,86.82 CONN10.7
CLO
  Bottom 0.406: CONN10.2 14.11,88.16
  Bottom 0.61: 14.11,88.16 R48.2
CSN
  Bottom 0.254: 41.88,75.69 42.7,76.5 42.7,83.06 38.99,86.77 33.2,86.77
  Bottom 0.305: 29.59,118.67 29.59,90.37 33.2,86.77 | 41.88,75.69 39.75,75.69 38.99,76.45 38.99,77.93
  Bottom 0.406: CON1.4 28.79,119.47 29.59,118.67 | 38.99,77.93 U1.10
DAC  (via drill 0.6)
  Top 0.305: v68.43,66.93 54.97,66.93 54.84,67.06 52.04,67.06 50.9,65.91 34.37,65.91 U1.14
  Bottom 0.305: R22.2 82.74,88.17 83.41,87.5 86.08,87.5 89.38,84.2 89.38,80.52 86.97,78.11 81.76,78.11 81.13,77.47 79.86,77.47 77.44,75.06 74.78,75.06 72.11,72.39 71.35,72.39 71.09,72.64 69.82,72.64 69.06,71.88 69.06,71.37 68.3,70.61 68.3,67.06 v68.43,66.93
DAC1-10V
  Bottom 0.305: 52.08,4.94 CON5.2 53.1,7.02 R53.2
  Bottom 0.61: LED5.ANODE 52.08,4.94
DAC2-10V
  Bottom 0.305: R54.2 64.81,6.72 CON3.2
  Bottom 0.61: CON3.2 LED6.ANODE
ENABLE  (via drill 0.5)
  Top 0.254: S3.4 85.32,73.44 | 85.32,73.44 S3.3 | v85.19,73.31 85.32,73.44
  Bottom 0.254: IC1.3 87.81,67.45 87.81,70.93 v85.19,73.31
  Bottom 0.61: R56.2 90.05,66.54 IC1.3
FAN/TBD  (via drill 0.5)
  Top 0.305: CON9.4 91.12,60.75 90.55,61.32 81.61,61.32 v81.81,61.37
  Bottom 0.305: C15.1 88.35,57.84 CON9.4 91.12,60.6 88.16,60.6 87.06,61.71 R60.2 | v81.81,61.37 81.81,60.59 PTC3.1
FUELGAUGE
  Bottom 0.305: Q1.3 87.79,94.06 91.24,96.75 91.29,97.99 CON7.4
G
  Bottom 0.406: R51.2 10.26,85.32
  Bottom 0.61: 10.26,85.32 CONN10.3
GND  (via drill 0.5, 0.6)
  Top 0.254: S3.2 S3.1 80.74,77.99 v80.37,78.87
  Top 0.305: 81.76,77.95 S3.1
  Top 0.61: v24.74,60.61 C11.-
  Bottom 0.254: IC3.2 42.04,37.64 41.78,37.39 40.67,37.39 40,38.05 39.28,38.05 C43.2 | RN1.1 44.7,31.71 C41.1 46.12,31.87 v46.2,31.95 | U4.5 39.24,27.64 37.87,29.01 | 37.87,29.01 37.87,29.81 C40.2 | 37.87,29.01 37.87,28.24 v37.57,27.94 | R35.2 52.78,31.42 v52.76,31.39 | C19.2 56.31,35.15 v56.21,35.15 | R34.2 52.78,23.29 v52.55,23.06 | v51.64,26.26 51.77,26.39 C23.2 53.15,26.64 C24.2 | C20.2 51.62,38.29 52.55,39.22 52.81,39.22 v53.01,39.42 | IC1.2 89.94,68.4 v90.3,68.3 | R14.1 65.47,55.54 64.24,56.77 64.24,62.76 U1.AGND
  Bottom 0.305: 62.71,73.57 R10.1 62.61,73.41 | R1.2 v82.14,94.87 | U3.4 84.51,98.47 85.45,97.54 86.02,97.54 C28.2 86.13,96.16 v86.23,96.06 | U3.5 80.4,99.76 C29.2 78.37,99.76 v79.32,98.81 | R18.1 v88.52,96.16 | IC6.2 20.78,65.05 v22.99,62.84 | OPTO2.3 69.84,28.16 v69.77,28.5 | OPTO1.3 78.52,27.22 v78.51,27.23 | R24.1 66.74,28.92 v66.9,28.83 | 61.4,20.4 62.73,20.4 v62.76,20.37 | C55.1 61.63,69.63 v61.34,69.65 | C16.2 76.91,61.95 v77.09,61.01 | C18.2 74.8,61.42 v74.09,60.71 | 41.08,67.12 v41.22,67.26 | C10.2 50.8,66.86 R66.1 | C3.2 54.36,70.8 R16.1 55.43,70.88 v55.91,70.41 | 50.9,68 v50.98,68.07 | R45.2 59.89,14.3 v59.82,14.38 | R44.1 49.52,11.24 50.11,11.84 50.32,11.84 50.77,12.29 v51.89,12.29 | 73.44,52.78 R11.2 | LED8.CATHODE 93.84,50.94 v93.73,51.05 | OPTO3.3 78.73,48.3 v78.23,47.7 | OPTO3.2 C52.2 87.06,50.02 87.01,50.12 v87.02,50.11 | OPTO4.3 79.84,56.71 v80.11,56.39 80.52,55.98 C15.2 86.32,56.06 OPTO4.2
  Bottom 0.406: 92.62,64.76 v92.53,64.85 93.17,65.61 | R10.1 64.1,73.72 | 64.1,73.72 v64.13,73.66 | R9.1 64.09,73.75 64.09,73.73 64.1,73.72 | C47.2 20.83,65.87 20.85,67 20.85,68.08 IC6.2 | C49.2 23.99,73.76 22.02,73.76 19.63,76.15 CON11.2 17.96,75.31 17.96,72.95 17.84,72.83 C48.2 16.29,72.68 v16.28,72.69 | C50.2 26.85,74.98 v26.8,75.03 | R13.2 80.61,80.81 v80.64,81.03 | Q4.2 36.64,91.94 v36.6,91.9 | Q3.2 60.09,94.15 v59.16,93.22 | R19.2 92.18,83.52 v90.6,81.94 | C30.2 74.03,69.83 73.84,69.65 73.84,68.46 IC4.3 | IC4.3 72.97,68.44 72.87,68.53 72.87,68.48 | IC4.3 73.73,68.44 v72.62,69.55 | C43.2 39.09,39.12 v38.38,39.83 | C7.2 36.94,67.5 v36.96,69.04 | C6.2 41.08,67.12 | R66.1 50.9,68 | IC5.4 23.5,91.6 | R47.2 16.14,84.24 | R11.2 73.57,52.8 v73.53,54.1 | GND.MP 40.82,51.49 41.88,50.42 41.8,50.17 NTC1.2 | v93.68,59.44 95.43,59.44 LED9.CATHODE | C51.1 13.37,101.53 v12.67,100.84
  Bottom 0.61: v83.21,66.14 C14.2 83.03,67.48 | v85.72,64.34 87.26,64.08 | 87.26,64.08 C5.2 | v92.53,64.85 89.87,64.85 89.1,64.08 87.26,64.08 | 93.17,65.61 93.17,66.26 C2.2 | U2.1 85.13,39.36 C1.2 85.9,37.87 v85.75,37.64 | C25.1 3.52,122.3 CON1.1 | C32.2 61.4,20.4 61.34,26.9 IC2.11 | 74.65,62.22 75.11,62.26 74.71,62.22 C9.2 72.26,64.21 v71.75,64.72 71.6,65.18 71.55,67.16 72.83,68.44 | C44.2 29.32,46.75 VREG2.2 | C4.2 70.13,64.62 70.03,64.62 | 70.03,64.62 66.09,64.62 U1.AGND | 70.03,64.62 v69.37,65.28 | C21.2 v24.74,60.61 | C17.2 87.35,37.92 v87.2,37.64 | 23.5,91.6 v19.91,88.9 | 16.14,84.24 v16.87,84.2
  Bottom 0.813: v20.42,102.11 21.68,101.85 C38.2
  Bottom 1.016: C12.2 v81.31,66.06 82.98,66.06 v83.21,66.14
  Bottom 1.27: v85.75,37.64 v87.2,37.64 | C31.2 37.87,53.7 v39.34,53.7
  other vias: 39.34,84.33 93.68,53.21 76.68,73.66 75.41,73.66 75.41,38.1 93.75,61.47 75.41,36.83 95.73,27.94 58.9,10.16 69.06,91.44 46.53,51.97 46.2,71.12 48.74,71.12 58.9,68.58 94.08,64.77 84.3,62.23 51.28,15.24 58.9,17.78 61.44,17.78 63.98,17.78 76.68,27.94 76.68,25.4 84.3,27.94 84.3,25.4 89.38,27.94 91.92,27.94 94.46,27.94 89.38,25.4 46.2,27.94 46.2,29.21 46.2,26.67 53.82,17.78 51.28,17.78 51.28,43.18 53.82,43.18 56.36,43.18 51.28,40.64 53.82,40.64 5.56,68.58 8.1,68.58 10.64,68.58 13.18,68.58 5.56,54.61 28.42,52.07 28.42,53.34 86.84,35.56 86.84,33.02 66.52,35.56 66.52,38.1 63.98,38.1 63.98,35.56 66.52,33.02 28.42,50.8 3.02,54.61 4.29,54.61 81.76,71.12 84.3,71.12 71.6,73.66 74.14,76.2 76.68,76.2 81.76,76.2 84.3,76.2 86.84,76.2 91.92,76.2 91.92,73.66 91.92,71.12 91.92,78.74 51.28,71.12 66.52,66.04 82.78,64.72 90.4,63.63 91.8,63.63 85.7,62.23 93.32,63.63 84.3,64.77 93.78,57.35 76.68,86.36 79.22,86.36 81.76,86.36 84.3,86.36 63.98,88.9 25.88,81.28 25.88,78.74 15.72,78.74 15.72,76.2 13.18,78.74 13.18,81.28 13.18,76.2 13.18,73.66 13.18,71.12 10.64,76.2 10.64,71.12 8.1,76.2 5.56,76.2 5.56,73.66 5.56,71.12 5.56,78.74 8.1,78.74 9.12,101.47 6.83,95.25 5.56,93.98 17.25,105.92 46.2,30.48 51.28,27.94 74.14,25.4 74.14,30.48 76.68,30.48 84.3,30.48 40.82,70.87 24.36,106.55 24.36,105.03
  pour InnerlayerGND1: -0.69,127.51 33.5,128.02 33.5,107.95 33.76,107.7 42.9,107.7 40.61,105.41 38.58,105.41 35.53,102.36 35.53,98.81 36.3,98.04 44.42,98.04 51.54,90.93 53.57,90.93 57.12,94.49 51.03,100.58 50.52,100.58 57.38,107.44 66.27,107.44 62.71,103.89 60.43,103.89 58.65,102.11 58.65,99.82 60.93,97.54 67.54,97.54 72.11,92.96 79.22,92.96 79.22,95.76 75.92,99.06 75.92,103.63 76.68,104.39 83.54,104.39 90.14,111 90.14,126.75 91.16,127.76 97.87,127.76 97.61,-1.32 46.56,-1.32 46.89,-0.99 arc45 46.96,-0.81 46.96,9.19 46.99,9.22 arc-45 47.17,9.3 48.44,9.3 48.21,9.53 arc-45 48.13,9.71 48.13,26.16 47.65,26.65 arc45 47.47,26.72 38.43,26.77 38.1,26.7 arc-45 38.02,26.88 37.46,27.03 37.46,34.69 37.57,45.26 25.07,45.52 25.12,53.7 23.42,53.72 arc45 23.24,53.8 -0.53,53.8
  pour InnerlayerAGND (isolate 0.254): 30.96,73.66 93.19,73.66 93.19,29.21 85.57,29.21 85.57,36.83 67.08,36.83 67.08,2.54 44.93,2.54 44.68,9.4 51.03,9.4 51.28,26.67 37.31,26.67 37.31,53.34 30.96,53.34
ICHG  (via drill 0.5)
  Top 0.254: U1.A11 54.12,65.24 55.35,64.01 55.35,61.72 56.62,60.45 56.62,59.54
  Top 0.305: 56.62,59.54 ICHG.MP | v58.75,50.29 58.88,50.34 59.31,49.15 66.14,49.15 67.79,47.5 69.65,45.62 85.32,45.59 91.92,45.59 93.45,44.07 93.45,40.51 CON8.3
  Bottom 0.254: R16.2 52.95,72.58 52.76,72.39 52.76,67.56 54.66,67.56 53.99,67.36 C3.1
  Bottom 0.305: 58.75,57 58.75,57.15
  Bottom 0.406: C3.1 54.41,65.63 U1.A11 | 58.75,57 v58.75,50.29 | 58.75,57.15 ICHG.MP
IDISCHG  (via drill 0.5)
  Top 0.305: v48.84,49.02 49.3,48.31 65.86,48.26 67.51,46.61 69.47,44.63 84.94,44.7 87.99,44.7 89.89,42.8 89.89,35.94 91.01,34.83 CON8.2
  Bottom 0.254: C10.1 49,64.71 49.04,64.67 | v48.84,49.02 48.95,49 IDISCHG.MP
  Bottom 0.305: U1.19/A5 49.04,53.66
  Bottom 0.406: U1.19/A5 49.04,64.67 | C10.1 49.16,64.81 50.88,64.81 50.9,64.83 R66.2 | 49.04,53.66 IDISCHG.MP
KEYSWINLO
  Bottom 0.305: Z3.1 72.96,16.27 72.06,17.17 69.88,17.17 69.72,17.32 69.72,18.43 C35.2 70.1,18.93 OPTO2.2 | 73.63,13.46 CON6.1
  Bottom 0.406: 73.63,13.46 73.63,14.75 R37.1 73.57,16.02 Z3.1
KEYSWITCH-IN  (via drill 0.5)
  Top 0.305: v62.56,52.22 68.3,52.22 v71.81,48.72 | v70.54,2.44 70.08,3.5 70.08,25.25 v73.99,29.16
  Bottom 0.305: U1.23/A9 62.56,59.44 62.56,55.88 v62.56,52.22 | v71.81,48.72 71.81,31.72 71.4,31.32 71.4,29.22 R36.2 | R36.2 71.36,28.35 OPTO2.4 | 70.99,1.47 70.54,1.78 v70.54,2.44 | v73.99,29.16 R36.2
  Bottom 0.61: LED3.CATHODE 70.99,1.47
LD1-G  (via drill 0.5)
  Top 0.305: v41.43,55.47 41.43,55.37 67.59,55.37 67.89,55.12 73.63,49.83
  Top 0.406: 73.63,49.83 74.45,49.02 75.77,49.02 LD1.AX
  Bottom 0.406: U1.16/A2 41.42,59.65 41.43,56.64 v41.43,55.47
LD1-R
  Top 0.305: U1.15/A1 38.84,62.76 38.84,59.64 41.83,56.64 66.27,56.64 66.5,56.57 69.29,56.57 70.13,55.63
  Top 0.406: U1.15/A1 38.88,62.19 | 70.13,55.63 74.35,55.68 LD1.AR
  Bottom 0.406: U1.15/A1 38.88,64.11 C6.1
LIMP/TBD
  Bottom 0.305: PTC2.1 80.37,51.74 81.67,51.74 R58.2 | C52.1 91.34,50.17 CON9.1 91.42,50.09 91.16,50.09 89.48,51.05 86.33,51.05 86.33,50.95 82.27,50.95 81.86,51.36 81.86,52.28 R58.2 | R58.2 81.5,52.23
MICRO+3.3V  (via drill 0.5)
  Top 0.406: v46.05,84.63 v44.22,86.31
  Bottom 0.406: C25.2 5.42,122.37 CON1.2 30.42,122.01 31.22,121.21 31.22,90.37 33.86,87.73 42.8,87.73 v44.22,86.31 | U1.3.3V 61.74,63.23 65.56,67.06 66.52,67.06 67.08,67.61 67.08,71.73 69.47,74.12 69.47,84.63 v46.05,84.63
MISO
  Bottom 0.305: U1.12 33.8,79.51 26.29,87.02 26.29,113.84 25.68,114.45 8.25,114.45 6.78,112.98 3.94,112.98 2.77,114.15 2.99,114.15 CON1.7
MOSI
  Bottom 0.305: CON1.6 27.62,116.93 28.17,116.38 28.17,88.44 36.25,80.37 36.25,78.13 U1.11
N$1  (via drill 0.5)
  InnerlayerGND1 0.305: v91.21,124.26 91.21,124.31 89.43,126.09
  InnerlayerGND1 0.406: v60.43,106.88 62.26,108.71 62.26,124.31 62.2,124.36 63.93,126.09 89.43,126.09
  Bottom 0.305: LED2.CATHODE 89.89,125.58 v91.21,124.26
  Bottom 0.406: v60.43,106.88 60.53,106.88 61.09,107.44 R6.1
N$2  (via drill 0.5)
  Top 0.305: v66.01,18.74 65.94,30.15 64.39,32.41 58.19,32.41 v58.04,32.26
  Bottom 0.305: R42.2 54.01,33.8 54.38,34.16 58.04,34.16 v58.04,32.26 58.04,30.78 IC2.7 | R54.1 66.51,18.25 v66.01,18.74
N$3  (via drill 0.5)
  Top 0.305: v78.33,54.1 78.33,49.28 76.68,47.62 74.4,47.62 68.68,53.34 51.16,53.34 50.14,54.36 44.81,54.36 43.92,53.47 XTS.MP
  Bottom 0.305: R21.1 43.92,62.84 U1.17/A3 43.92,62.76
  Bottom 0.406: 43.92,62.76 XTS.MP 44.02,51.92 43.97,50.95 43.97,50.16 NTC1.1 | CON9.3 91.21,56.13 88.37,53.24 79.12,53.24 78.92,53.44 78.38,54.05 78.33,54.15 v78.33,54.1
N$4
  Bottom 0.254: R39.2 R38.1
N$5
  Bottom 0.254: R40.2 R39.1
N$6  (via drill 0.6)
  Top 0.406: R55.2 10.26,101.22 12.93,98.55 12.93,94.49 v14.07,93.34
  Bottom 0.406: IC5.6 14.03,94.35 | 14.03,94.35 13.15,94.27 12.32,93.45 12.32,91.31 12.98,90.78 13.6,90.78 R48.1 | v14.07,93.34 14.07,94.31 14.03,94.35
N$7
  Bottom 0.406: F1.P$1 12.82,6.58 | 9.25,13.21 9.37,13.21
  Bottom 0.813: NTC2.2 6.28,16.17 9.25,13.21 | 9.37,13.21 10.13,12.45 10.13,7.11 11.53,5.71 F1.P$1
N$8
  Top 1.27: TB1.2 77.37,113.87 70.18,106.68 70.18,101.49 K1.NC
N$9  (via drill 0.5)
  InnerlayerGND1 0.406: v55.96,101.04 60.32,96.67 60.17,96.67 v59.87,96.98
  Bottom 0.406: R6.2 61.58,105.36 59.46,105.36 57.4,103.3 D1.A 57.4,102.49 v55.96,101.04 | v59.87,96.98 60.69,96.98 Q3.3
  Bottom 0.61: K1.V- 64.33,106.42 63.98,105.97 62.85,105.97 R6.2
N$10
  Bottom 0.305: R13.1 85.61,82.51 LD2.C
N$11
  Bottom 0.305: IC2.2 57.02,24.36 56.01,23.34 R34.1 R41.1
N$13
  Bottom 0.254: LD2.AX 78.61,79.76 73.18,85.85 59.54,85.85 59.03,86.36 46.08,86.36 43.96,84.16 U1.8
N$14  (via drill 0.5)
  Top 0.305: v68.35,83.69 81.33,83.74 82.63,84.94 85.72,84.94 LD2.AR
  Bottom 0.305: U1.7 46.46,83.67 67.67,83.67 v68.35,83.69
N$15
  Bottom 0.305: R30.1 55.46,25.63 | 55.46,25.63 55.46,26.24 C23.1 | IC2.3 55.46,25.63
N$16
  Bottom 0.305: 91.52,6.5 CON4.2 90.98,7.04 R29.2
N$17
  Bottom 0.61: TP-EN1.MP 21.7,38.6 21.7,38.51 18.69,38.51 VREG1.1
N$18
  Bottom 0.305: U3.7 79.02,101.05 79.02,100.64 79.02,100.46 80.36,100.46 U3.6
N$19
  Bottom 0.406: R11.1 71.77,52.67 72.42,51.36 75.62,51.36 LD1.C
N$20  (via drill 0.5)
  Top 0.305: v87.3,95.1 87.3,91.03 v87.66,89.81
  Bottom 0.305: R18.2 86.43,99.02 C28.1 | U3.3 85.31,100.39 C28.1 | C28.1 87.39,99.17 87.4,99.16 87.4,99.01 87.5,98.91 87.5,95.3 v87.3,95.1 | v87.66,89.81 85.06,89.83 R22.1
N$21
  Bottom 0.305: 60.63,92.76 60.66,92.76 | 60.66,92.76 61.54,92.76 62,93.27 62,93.91 Q3.1 | R3.1 59.37,91.35 60.66,92.76
N$22  (via drill 0.6)
  Top 0.406: R52.2 14.71,106.43 13.94,105.66 13.94,96.27 v14.2,96.01
  Bottom 0.406: R49.1 4.28,89.14 6.2,91.06 7.59,91.06 13.56,97.03 14.52,97.03 IC5.7 14.2,96.53 v14.2,96.01
N$23
  Bottom 0.406: R4.1 38.48,93.68 Q4.1
N$24
  Bottom 0.305: C36.1 80.85,18.83 OPTO1.1 81.04,20.93 R20.1
N$25  (via drill 0.5)
  Top 0.305: v90.25,97.18 v89.74,93.88
  Bottom 0.305: U3.1 84.91,101.7 85.52,102.82 86.38,103.02 C33.1 86.34,102.67 87.71,102.67 89.94,99.62 89.94,97.74 v90.25,97.18 | R7.2 88.3,93.1 89.03,93.17 v89.74,93.88
N$26
  Bottom 0.305: 85.09,67.33 R46.1
  Bottom 0.61: C5.1 86.53,66.84 IC1.4 86.28,67.33 85.09,67.33
N$27
  Bottom 0.305: R7.1 86.48,92.84 Q1.1
N$28
  Bottom 0.305: R1.1 83.48,91.73 Q1.2 83.29,92.18 83.29,95.71 82.78,96.22 R5.2
N$29
  Bottom 0.305: R20.2 84.87,19.92 Z2.3 86.12,17.27 R17.2 87.25,15.19 R29.1
N$30
  Top 1.27: TB1.3 67.98,116.39 71.73,120.14 82.14,120.14 82.14,107 K1.NO
N$31
  Bottom 1.27: TB1.1 80.24,120.68 72.75,120.7 72.75,109.22 64.57,101.14 62.46,101.17 K1.COM
N$32
  Bottom 0.305: IC2.6 56.64,29.44 56.26,29.82 56.26,31.3 R35.1 R42.1
N$33
  Bottom 0.305: IC2.5 55.24,28.17 C24.1 55.05,30.1 R31.1
N$34
  Bottom 0.305: R27.1 C20.1 51.33,30.18 51.69,29.82 53.25,29.82 R31.2
N$35
  Bottom 1.27: K2.COM 41.52,100.98 41.99,100.99 55.14,114.1 56.07,114.1 TB2.1
N$36
  Top 1.27: TB2.2 46.61,112.83 46.28,111.51 46.28,108.71 46.2,100.84 48.87,98.2 49.75,98.15 K2.NC
N$37
  Bottom 0.305: C33.2 86.07,101.05 U3.2 82.98,101.04 82.78,100.84 R5.1
N$38
  Bottom 0.305: IC2.8 65.63,30.71 65.66,30.73 65.66,29.52 65.61,29.46 63.33,29.46 IC2.9
N$39
  Top 1.27: TB2.3 37.3,117.11 41.05,120.9 49.38,120.9 51.61,118.67 51.71,108.25 K2.NO
N$40
  Bottom 0.305: IC2.13 65.79,24.36 65.81,24.33 65.81,23.11 65.86,23.06 63.33,23.06 IC2.14
N$41
  Bottom 0.305: IC2.12 65.1,25.63 | 65.1,25.63 65.82,25.63 R24.2 | IC2.10 64.62,28.17 64.95,27.84 64.95,25.78 65.1,25.63
N$42  (via drill 0.5)
  Top 0.305: v84.2,32.05 76.43,32.05 v76.38,32
  Bottom 0.305: 87.25,29.01 v84.2,32.05 | v76.38,32 76.38,32.04 R28.1
  Bottom 0.61: LED1.ANODE 94.39,1.55 95.63,2.79 95.63,14.88 87.25,23.27 87.25,29.01
N$43
  Bottom 0.305: R33.1 71.44,20.78 OPTO2.1 71.37,18.68 C35.1
N$44
  Bottom 0.305: Z3.3 75.52,19.64 R33.2 | R32.1 R37.2
  Bottom 0.406: R37.2 75.27,15.86 75.77,16.36 75.77,16.98 Z3.3
N$45  (via drill 0.5)
  Top 0.305: v68.61,12.7 68.61,31.27 v68.36,31.51
  InnerlayerGND1 0.305: v69.27,1.57 69.42,1.42 v80.04,1.42
  Bottom 0.305: R43.1 v68.36,31.51 | v69.27,1.57 69.27,12.04 v68.61,12.7
  Bottom 0.61: LED3.ANODE v80.04,1.42
N$46
  Bottom 0.61: PTC1.2 D2.C
N$47  (via drill 0.5)
  Top 0.305: v58.87,36.02 58.78,36.07 58.32,36.52 53.67,36.52 49.81,32.66 49.81,26.52 51.54,24.79 52.53,24.79 v52.58,24.74
  Bottom 0.305: TP2.MP v58.87,36.02 R26.1 58.13,37.3 57.28,38.15 56.5,38.15 C19.1
  Bottom 0.406: R30.2 v52.58,24.74
N$48  (via drill 0.5)
  InnerlayerGND1 0.305: v33.83,106.68 33.83,106.86 31.98,108.71 31.98,110.08 31.88,110.19
  InnerlayerGND1 0.406: 31.88,110.19 31.88,123.55 33.86,125.53 60.48,125.53 v60.53,125.53
  Bottom 0.406: LED4.CATHODE v60.53,125.53 | v60.53,125.53 | R8.1 33.97,106.67 v33.83,106.68
N$49
  Bottom 0.305: R44.2 51.22,10.65 51.18,10.62 51.18,10.41 50.52,9.75 50.52,8.28 49,4.27 | 49,1.49 LED5.CATHODE
  Bottom 0.61: 49,4.27 49,1.49
N$50
  Bottom 0.305: LED6.CATHODE 61.38,1.97 | 62.97,4.67 62.97,12.85 63.03,13.8 62.95,14.44 R45.1
  Bottom 0.61: 61.38,1.97 62.97,4.67
N$51  (via drill 0.6)
  Top 0.406: v18.9,101.35 15.72,101.35 15.72,101.22 15.21,100.71 15.21,96.65 15.47,96.65 15.47,95.5 15.21,95.25 15.21,91.31 v16.36,90.17
  Bottom 0.406: C46.1 17.45,101.3 18.85,101.3 v18.9,101.35 | R51.1 15.51,85.85 R47.1 15.72,85.85 15.72,90.17
  Bottom 0.61: 15.72,85.85 15.72,90.75 IC5.5 | v16.36,90.17 15.72,90.17
N$52
  Bottom 0.254: R40.1 29.84,17.05 R2.2 37.27,12.38 39.29,12.39 41.58,12.39 42.6,13.41 43,14.34 C8.1 | U4.2 42.37,15.88 42.85,15.39
  Bottom 0.305: 42.85,15.39 42.85,14.49 C8.1
N$53  (via drill 0.5)
  Top 0.305: v82.47,63.09 82.78,63.4 88.01,63.4 93.9,69.29 93.9,78.64 92.38,80.16 89.79,80.16 88.93,81.03 84.15,81.03 83.35,81.02 83.35,81.04 81.36,79.81 80.44,79.81 79.48,80.77 67.84,80.72 TP-SW/FAN.MP
  Bottom 0.305: R59.2 84.61,60.1 82.63,62.08 82.63,62.94 v82.47,63.09 | U1.2 59.37,78.04 60.99,79.65 61.49,79.65 62.2,80.37 62.2,81.28 62.76,81.84 63.5,81.84 R12.2 65.72,81.98 TP-SW/FAN.MP
N$54
  Bottom 0.61: D2.A 3.29,64.31 | 3.29,64.31 VREG1.14 | D7.GATE 3.29,64.31
  Bottom 1.27: D7.SOURCE D7.GATE
N$55
  Bottom 0.305: RN1.2 42.16,31.26 42.54,30.48 42.54,29.11 42.29,28.4 42.24,27.77 U4.7
N$56
  Bottom 0.305: RN1.3 41.36,31.12 41.88,30.18 41.88,29.57 41.07,27.74 41.07,27.67 U4.6
N$57
  Bottom 0.305: IC3.4 42.99,35.7 42.14,34.8 41.73,34.8 41.33,34.39 41.33,33.34 RN1.6 RN1.5
  Bottom 0.406: IC3.4 44.55,36.11 C42.2
N$58  (via drill 0.5)
  Top 0.305: v43.97,37.19 43.97,35.15 v43.46,34.49
  Bottom 0.305: C41.2 43.41,33.77 | 43.41,33.77 RN1.8 RN1.7 | IC3.3 43.19,38.72 43.21,37.85 v43.97,37.19 | v43.46,34.49 43.46,33.81 43.41,33.77
N$59
  Bottom 0.61: C51.2 11.47,103.7 11.91,104.14 12.04,104.14 12.17,104.27 13.56,104.27 | 13.56,104.27 R55.1 | R52.1 12.8,106.43 13.56,105.66 13.56,104.27
N$60
  InnerlayerGND1 0: 15.72,100.46 22.58,100.46 22.58,91.06 15.72,91.06 15.72,100.33
N$61  (via drill 0.5)
  Top 0.305: U1.1 61.74,79.97 v60.93,80.77 | v47.62,80.82 38.13,80.82 v37.67,80.42 | v32.64,68.68 26.03,68.68 25.32,69.39 25.32,76.94 25.27,76.99
  Top 0.406: CON11.1 25.27,76.99 TX1.MP
  Bottom 0.254: v37.67,80.42 37.67,73.71
  Bottom 0.305: 62.92,75.41 R10.2 | v60.93,80.77 47.68,80.77 v47.62,80.82 | 37.67,73.71 v32.64,68.68
  Bottom 0.406: U1.1 61.74,77.18 62.92,76 62.92,75.41
N$62
  Bottom 0.406: LED7.CATHODE 94.43,88.92 94.06,88.54 94.06,83.53 R19.1
N$63
  Bottom 0.406: C48.1 19.74,70.84 IC6.4
N$64
  Bottom 0.305: R32.2 CON6.2
N$65
  InnerlayerGND1 0: 8.61,124.21 8.56,107.98 31.39,107.95 31.34,124.21 8.61,124.21
N$66
  Bottom 0.305: LED8.ANODE 94.66,52.02 84.56,52.02 84.25,51.97 R58.1
N$67
  Bottom 0.305: 85.29,50.01 85.29,49.96 OPTO3.1 85.18,49.94 84.51,49.94 84.05,49.48 84.05,47.4 83.29,46.63 R57.1
N$68
  Bottom 0.305: PTC2.2 78.22,51.14 78.71,50.65 78.71,49.97 OPTO3.4
N$69
  Bottom 0.305: R60.1 89.64,62.13 89.99,62.48 94.65,62.48 LED9.ANODE
N$70
  Bottom 0.305: R59.1 86.52,59 OPTO4.1
N$71
  Bottom 0.305: PTC3.2 80.05,59.01 OPTO4.4
N$72  (via drill 0.5)
  Top 0.305: S1.2 S1.1 68.77,82.13 68.2,82.7 64.69,82.7 64.44,82.45 64.44,80.52 v64.74,80.21
  Bottom 0.305: v64.74,80.21 63.71,80.21 R12.1
NON-ISOLATED-5V
  Bottom 0.406: 13.69,99.57 14.52,99.57 IC5.8 | 15.72,101.75 C46.2
  Bottom 0.61: R50.1 4.15,84.32 2.87,85.6 2.87,89.51 5.56,92.08 7.09,92.08 13.06,98.17 13.06,98.93 13.69,99.57 | C46.2 14.67,100.19 IC5.8 | R23.2 16.45,103.09 15.72,102.49 15.72,101.75
PACKGND  (via drill 0.5)
  Top 0.61: C22.2 1.98,31.05 C27.2
  Bottom 0.305: U4.3 C8.2 40.34,13.49 v39.24,13.46
  Bottom 0.406: U4.4 39.83,15.61 C8.2 | C39.2 44.31,13.25 v43.31,12.6
  Bottom 0.61: R2.1 31.43,19.47 v31.29,19.51 | C45.2 VREG2.4 C37.2
  Bottom 0.813: Z1.A 26.43,10.39
  Bottom 1.27: VREG1.3 VREG1.2 16.38,40.89 15.67,40.18 15.67,35.61 16.38,34.9 17.33,34.9 C26.2 | 26.43,10.39 CON2.3
  Bottom 1.422: 25.93,35.51 v25.98,35.46 v25.98,34.19
  pour InnerlayerAGND (isolate 0.406): -0.28,44.2 23.6,44.2 25.12,42.67 32.99,42.67 32.99,17.53 33.5,18.03 46.71,18.03 46.46,17.78 46.46,12.95 45.69,12.19 36.3,12.19 32.99,8.89 32.99,-0.51 -0.28,-0.51
PWM1
  Bottom 0.305: 51.58,52.79 61.34,43.03 61.34,40.34 TP1.MP 60.41,39 R26.2
  Bottom 0.406: U1.20/A6 51.58,52.79
PWM2  (via drill 0.5)
  Top 0.305: v56.92,41.25 58.09,42.47 62.81,42.47 65.1,40.23 TP3.MP
  Bottom 0.305: 54.12,53.15 63.47,43.69 63.47,41.61 TP3.MP | R27.2 53.81,38.09 56.01,40.28 56.06,40.39 v56.92,41.25
  Bottom 0.406: U1.21/A7 54.12,53.15
RELAYDR1  (via drill 0.5)
  Top 0.305: v51.64,88.01 51.63,79.03 51.63,78.09 U1.5
  Bottom 0.305: v51.64,88.01 56.72,88.01 TP-REL1.MP 58.01,89.05 58.61,89.65 R3.2
RELAYDR2  (via drill 0.5)
  Top 0.305: v48.95,87.78 48.95,86.92 49.05,86.82 49.05,78.05 U1.6
  Bottom 0.406: R4.2 40.78,91.61 44.04,92.84 48.97,92.81 48.95,88.04 v48.95,87.78
RX-CAN  (via drill 0.5)
  Top 0.305: U1.4 54.12,77.51 53.37,76.76 35.74,76.76 35.08,77.37 35.08,78.99 26.75,87.38 23.9,87.38 23.44,88.59 23.44,89.79 24.99,91.82 v24.97,96.01
  Bottom 0.305: v24.97,96.01 24.89,96.85 24.74,96.83 24.53,96.83 IC5.2
SCK
  Top 0.305: CON1.5 3.3,116.93
  Bottom 0.254: 35.13,79.2 35.13,74.83 34.06,73.76 33.68,73.76 31.39,71.48
  Bottom 0.305: 3.3,116.93 3.3,116.36 4.04,115.62 26.64,115.62 27.41,114.86 27.41,86.92 35.13,79.2 | U1.13 31.39,64.82 31.39,71.48
  Bottom 0.61: 3.3,116.93 CON1.5
TPF1A
  Bottom 0.406: 11.19,17.02 NTC2.1 11.15,17.23
  Bottom 0.61: R38.2 21.06,17.78 20.8,17.53 20.55,17.78 20.17,17.91 | 11.4,17.27 11.19,17.02
  Bottom 0.813: 20.17,17.91 11.91,17.91 11.4,17.27 | D6.A 11.91,15.24 11.15,16 11.15,17.23
TX-CAN  (via drill 0.5)
  Top 0.305: v28.12,69.85 30.51,69.85 32.38,71.73 32.49,71.73 35.53,74.78 v56.82,74.78
  Bottom 0.305: IC5.3 24.83,94.4 25.22,94.01 25.22,91.16 22.83,89.41 22.83,86.51 28.52,80.82 28.52,70.26 v28.12,69.85 | 56.82,77.88 U1.3
  Bottom 0.406: v56.82,74.78 56.82,77.88
VBAL
  Top 0.254: 57.89,61.47 57.89,63.86 57.63,64.11
  Top 0.305: U1.A10 56.66,64.93 57.48,64.11 57.63,64.11 | VBAL/2.MP 60.15,59.2 57.89,61.47
  Bottom 0.254: VBAL/2.MP 66.27,59.02 R14.2 R15.1
VIN  (via drill 0.5)
  Top 0.61: 11.72,34.39 C26.1 | 7.06,31.05 C27.1
  Top 1.016: 11.72,34.39 C13.+ 11.72,22.8 13.18,21.34 19.79,21.34 | C26.1 8.71,34.4 C22.1 7.06,31.05 | C34.+ 23.87,21.34 19.79,21.34 | v19.86,15.24 19.86,21.26 19.79,21.34
  Bottom 0.406: v19.86,15.24 D6.C
  Bottom 0.813: Z1.C 21.18,8.13 21.18,12.95 19.86,14.27 v19.86,15.24
  Bottom 1.27: VREG1.22 VREG1.23 4.19,40.89 7.09,38 7.09,34.56 C22.1
VPACK
  Bottom 0.61: CON2.1 6.23,7.62
  Bottom 0.813: 6.23,7.62 F1.P$2
VSCALED-PACK  (via drill 0.5)
  Top 0.305: v39.45,34.8 39.45,38.76 v40.31,39.62 | U1.14/A0 36.34,56.99 v32.64,53.29
  Bottom 0.254: C7.1 35.73,65.48 35.79,64.77 | 36.3,44.81 41.02,40.08 | 41.02,40.08 41.02,39.27 41.02,38.79 IC3.1 | C42.1 45.72,39.45 44.63,40.54 41.48,40.54 41.02,40.08
  Bottom 0.305: RN1.4 39.89,31.71 39.7,31.9 39.7,34.54 v39.45,34.8 | v40.31,39.62 40.82,39.47 41.02,39.27 | v32.64,53.29 32.64,50.8 36.35,47.09 36.35,44.86 36.3,44.81
  Bottom 0.406: 35.79,64.77 35.79,63.73 U1.14/A0
(copper drawn outside any net)
  shapes: Bottom circle x1

## Text on the board
tPlace: NC | MOTOR | NO | NC | CHARGE | NO | RF24 COMM | FUELGAUGE | F | CAN BUS | - | - | CLO | + | CHI | CGD | 12V/100ma | +5V | WIFI | GND | Copyright 2015-2019 Offgrid Systems LLC | XTS | DKblock Sep 30 2019 | GND | - | OC | GND | CH | DIS | +5V | CURRENT SENSE | + | - | VBAT IN | CHAS | G | DAC1 | + | G | DAC2 | + | - | KEYSW | + | - | CHG | + | - | +
bPlace: NC | MOTOR | NO | NC | CHARGE | NO | 14 | 11 | 16 | 9 | 22 | 3 | 23 | 1
tNames: RF24
DesNotes: TIM - NEED to add "CHeck Pack" light and output for DASH light... | RF Keepout for RF24 antenna | IPC Clearance chart IPC-2221B for 200VDC: / Exernal copper = 0.0492 in / Internal copper = 0.0079 in / Coated board = 0.016 in / Clearance for 12VDC = 0.0039 min or 5 mils for IPC9592 | Keepout CANBUS isolation